# EAGLE design 3dprinter (EAGLE 8.1.1)

## Sheet 1 of 2
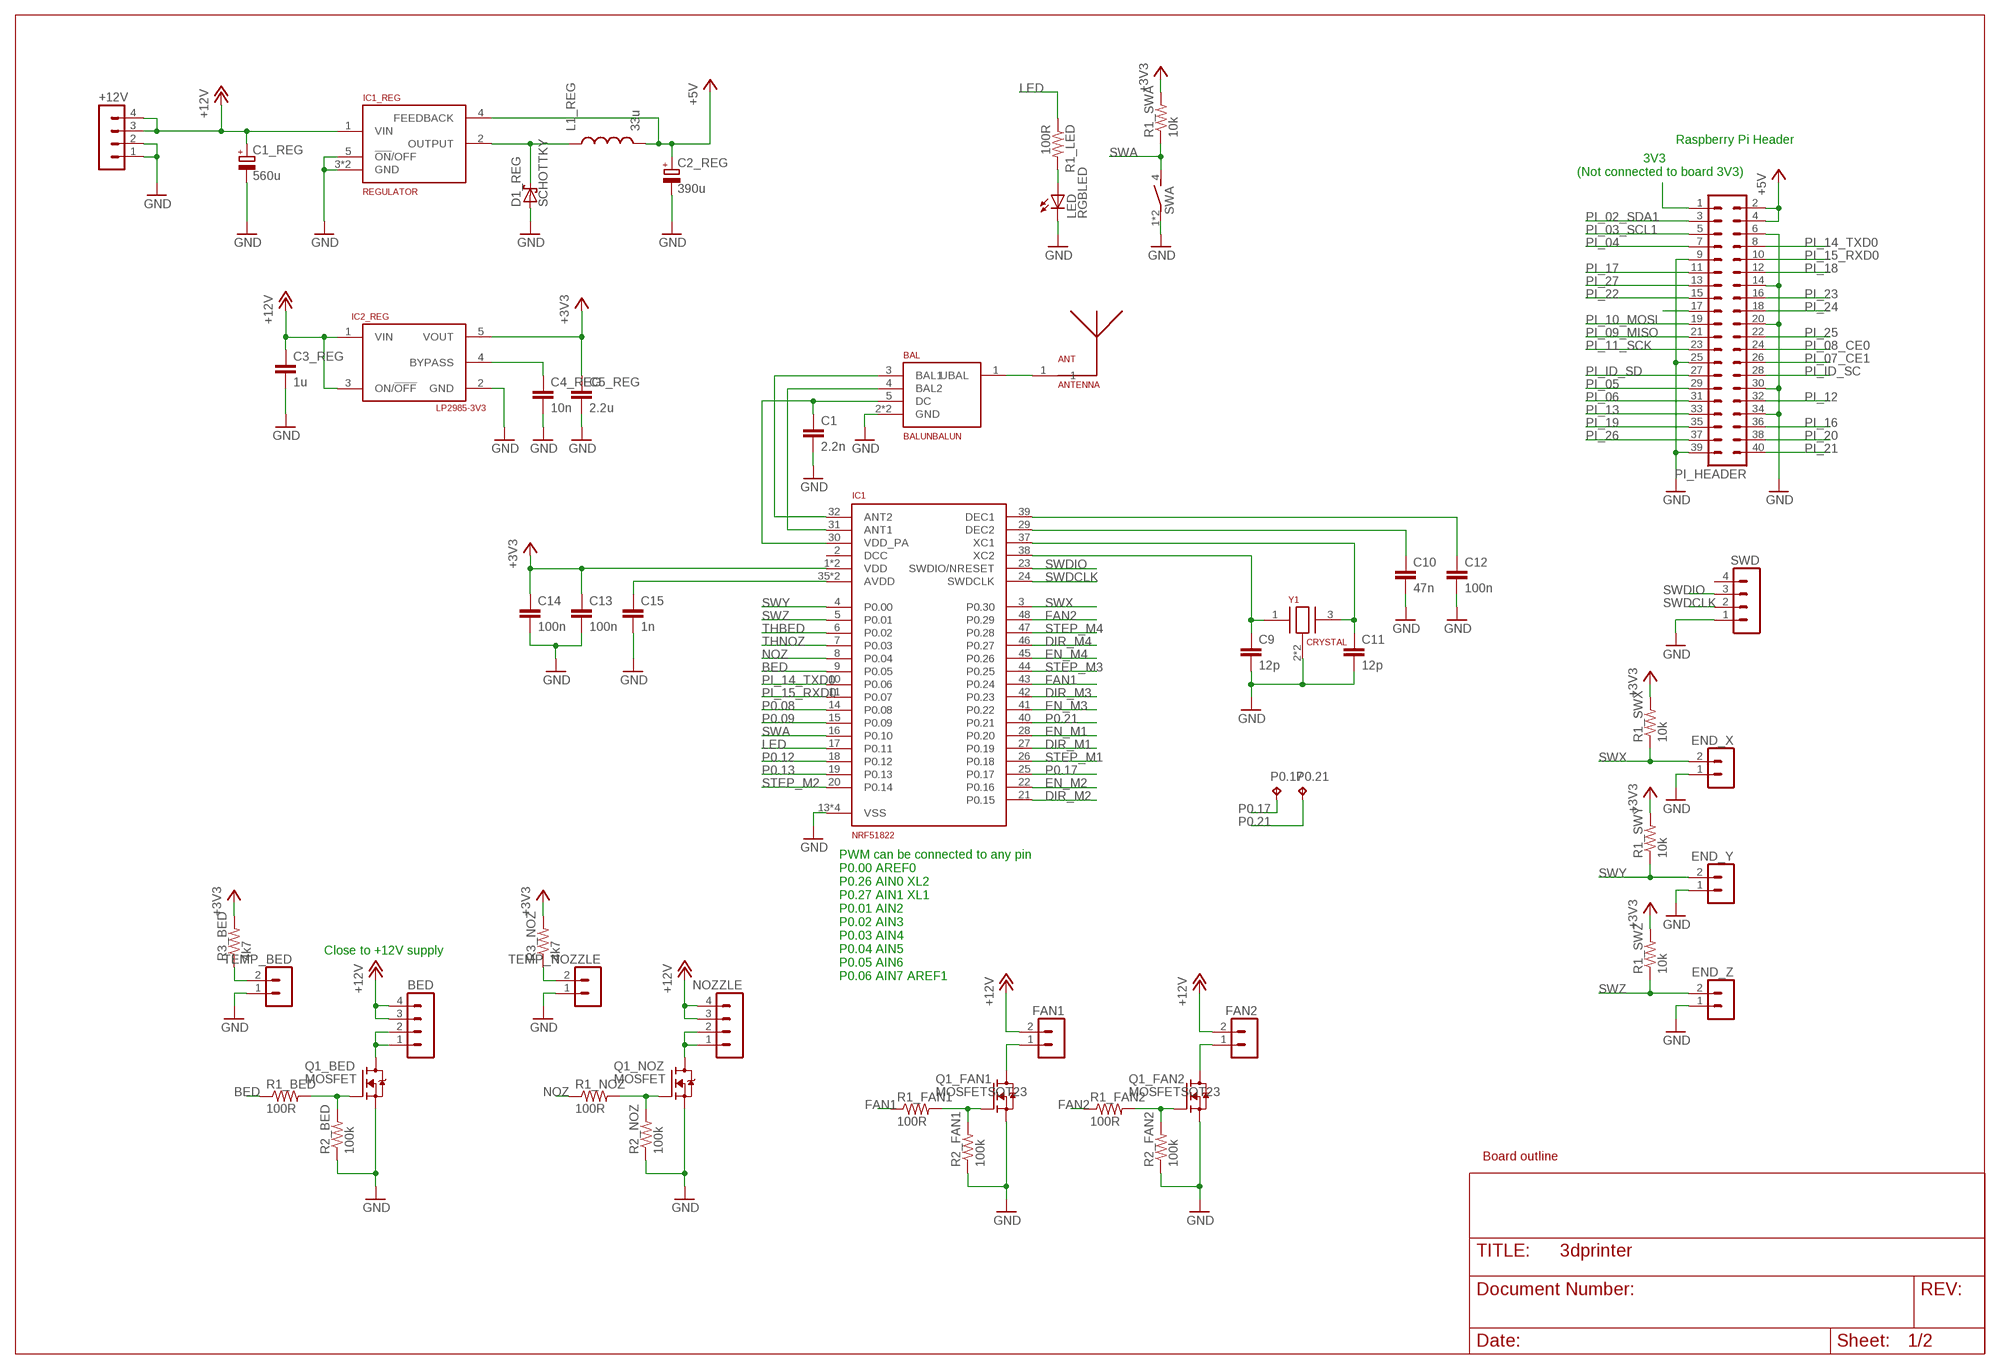
[diagram p0: schematic, sheet 1]

### Parts
+12V  MA04-15.08  [MA04-1_5MM]
ANT  ANTENNA  [ANTENNA]
BAL  BALUNBALUN  [BALUN]
BED  MA04-12.54  [MA04-1]
C1  2.2n  C-EUC0603  [C0603]
C1_REG  560u  TANTULUM  [TANTULUM]
C2_REG  390u  TANTULUM  [TANTULUM]
C3_REG  1u  C-EUC0805  [C0805]
C4_REG  10n  C-EUC0603  [C0603]
C5_REG  2.2u  C-EUC0805  [C0805]
C9  12p  C-EUC0603  [C0603]
C10  47n  C-EUC0603  [C0603]
C11  12p  C-EUC0603  [C0603]
C12  100n  C-EUC0603  [C0603]
C13  100n  C-EUC0603  [C0603]
C14  100n  C-EUC0603  [C0603]
C15  1n  C-EUC0603  [C0603]
D1_REG  SCHOTTKY  [SCHOTTKY]
END_X  MA02-12.54  [MA02-1]
END_Y  MA02-12.54  [MA02-1]
END_Z  MA02-12.54  [MA02-1]
FAN1  MA02-12.54  [MA02-1]
FAN2  MA02-12.54  [MA02-1]
IC1  NRF51822  [QFN48]
IC1_REG  REGULATOR  [REGULATOR]
IC2_REG  LP2985-3V3  [SOT23]
L1_REG  33u  INDUCTOR  [INDUCTOR]
LED  RGBLED  [RGBLED]
NOZZLE  MA04-12.54  [MA04-1]
OUTLINE  OUTLINE  [OUTLINE]
P0.17  TPB1,27  [B1,27]
P0.21  TPB1,27  [B1,27]
PI_HEADER  MA20-2  [MA20-2]
Q1_BED  MOSFET  [MOSFET]
Q1_FAN1  MOSFETSOT23  [SOT23_FAN]
Q1_FAN2  MOSFETSOT23  [SOT23_FAN]
Q1_NOZ  MOSFET  [MOSFET]
R1_BED  100R  R-US_R0603  [R0603]
R1_FAN1  100R  R-US_R0603  [R0603]
R1_FAN2  100R  R-US_R0603  [R0603]
R1_LED  100R  R-US_R0603  [R0603]
R1_NOZ  100R  R-US_R0603  [R0603]
R1_SWA  10k  R-US_R0603  [R0603]
R1_SWX  10k  R-US_R0603  [R0603]
R1_SWY  10k  R-US_R0603  [R0603]
R1_SWZ  10k  R-US_R0603  [R0603]
R2_BED  100k  R-US_R0603  [R0603]
R2_FAN1  100k  R-US_R0603  [R0603]
R2_FAN2  100k  R-US_R0603  [R0603]
R2_NOZ  100k  R-US_R0603  [R0603]
R3_BED  4k7  R-US_R0603  [R0603]
R3_NOZ  4k7  R-US_R0603  [R0603]
SWA  BUTTON  [BUTTON]
SWD  MA04-12.54  [MA04-1]
TEMP_BED  MA02-12.54  [MA02-1]
TEMP_NOZZLE  MA02-12.54  [MA02-1]
Y1  CRYSTAL  [CRYSTAL]

### Nets
+3V3: C5_REG.1 C13.1 C14.1 IC1.1(VDD) IC1.12(VDD) IC2_REG.5(VOUT) R1_SWA.2 R1_SWX.2 R1_SWY.2 R1_SWZ.2 R3_BED.2 R3_NOZ.2 ; also sheet 2
+5V: C2_REG.+ IC1_REG.4(FEEDBACK) L1_REG.2 PI_HEADER.2 PI_HEADER.4
+12V: +12V.3 +12V.4 BED.3 BED.4 C1_REG.+ C3_REG.1 FAN1.2 FAN2.2 IC1_REG.1(VIN) IC2_REG.1(VIN) IC2_REG.3(ON/!OFF) NOZZLE.3 NOZZLE.4 ; also sheet 2
ANT: ANT.1 BAL.1(UBAL)
BED: IC1.9(P0.05) R1_BED.1
BED-: BED.1 BED.2 Q1_BED.TAB(D)
BEDG: Q1_BED.4(G) R1_BED.2 R2_BED.2
DIR_M1: IC1.27(P0.19) ; also sheet 2
DIR_M2: IC1.21(P0.15) ; also sheet 2
DIR_M3: IC1.42(P0.23) ; also sheet 2
DIR_M4: IC1.46(P0.27) ; also sheet 2
EN_M1: IC1.28(P0.20) ; also sheet 2
EN_M2: IC1.22(P0.16) ; also sheet 2
EN_M3: IC1.41(P0.22) ; also sheet 2
EN_M4: IC1.45(P0.26) ; also sheet 2
FAN1: IC1.43(P0.24) R1_FAN1.1
FAN1-: FAN1.1 Q1_FAN1.3(D)
FAN1G: Q1_FAN1.1(G) R1_FAN1.2 R2_FAN1.2
FAN2: IC1.48(P0.29) R1_FAN2.1
FAN2-: FAN2.1 Q1_FAN2.3(D)
FAN2G: Q1_FAN2.1(G) R1_FAN2.2 R2_FAN2.2
GND: +12V.1 +12V.2 BAL.2(GND) BAL.6(GND) C1.2 C1_REG.- C2_REG.- C3_REG.2 C4_REG.2 C5_REG.2 C9.2 C10.2 C11.2 C12.2 C13.2 C14.2 C15.2 D1_REG.A END_X.1 END_Y.1 END_Z.1 IC1.13(VSS) IC1.33(VSS) IC1.34(VSS) IC1.PAD(VSS) IC1_REG.3(GND) IC1_REG.5(!ON!/OFF) IC1_REG.TAB(GND) IC2_REG.2(GND) LED.C PI_HEADER.6 PI_HEADER.9 PI_HEADER.14 PI_HEADER.20 PI_HEADER.25 PI_HEADER.30 PI_HEADER.34 PI_HEADER.39 Q1_BED.1(S) Q1_BED.2(S) Q1_BED.3(S) Q1_FAN1.2(S) Q1_FAN2.2(S) Q1_NOZ.1(S) Q1_NOZ.2(S) Q1_NOZ.3(S) R2_BED.1 R2_FAN1.1 R2_FAN2.1 R2_NOZ.1 SWA.1 SWA.2 SWD.1 TEMP_BED.1 TEMP_NOZZLE.1 Y1.2 Y1.4 ; also sheet 2
IC1_ANT1: BAL.3(BAL1) IC1.32(ANT2)
IC1_ANT2: BAL.4(BAL2) IC1.31(ANT1)
IC1_AVDD: C15.1 IC1.35(AVDD) IC1.36(AVDD)
IC1_DEC1: C12.1 IC1.39(DEC1)
IC1_DEC2: C10.1 IC1.29(DEC2)
IC1_REG_OUT: D1_REG.C IC1_REG.2(OUTPUT) L1_REG.1
IC1_VDD_PA: BAL.5(DC) C1.1 IC1.30(VDD_PA)
IC1_XC1: C11.1 IC1.37(XC1) Y1.3
IC1_XC2: C9.1 IC1.38(XC2) Y1.1
IC2_REG_BYPASS: C4_REG.1 IC2_REG.4(BYPASS)
LED: IC1.17(P0.11) R1_LED.1
LEDA: LED.A R1_LED.2
NOZ: IC1.8(P0.04) R1_NOZ.1
NOZ-: NOZZLE.1 NOZZLE.2 Q1_NOZ.TAB(D)
NOZG: Q1_NOZ.4(G) R1_NOZ.2 R2_NOZ.2
P0.08: IC1.14(P0.08)
P0.09: IC1.15(P0.09)
P0.12: IC1.18(P0.12)
P0.13: IC1.19(P0.13)
P0.17: IC1.25(P0.17) P0.17.TP
P0.21: IC1.40(P0.21) P0.21.TP
PI_02_SDA1: PI_HEADER.3
PI_03_SCL1: PI_HEADER.5
PI_3V3: PI_HEADER.1
PI_3V32: PI_HEADER.17
PI_04: PI_HEADER.7
PI_05: PI_HEADER.29
PI_06: PI_HEADER.31
PI_07_CE1: PI_HEADER.26
PI_08_CE0: PI_HEADER.24
PI_09_MISO: PI_HEADER.21
PI_10_MOSI: PI_HEADER.19
PI_11_SCK: PI_HEADER.23
PI_12: PI_HEADER.32
PI_13: PI_HEADER.33
PI_14_TXD0: IC1.10(P0.06) PI_HEADER.8
PI_15_RXD0: IC1.11(P0.07) PI_HEADER.10
PI_16: PI_HEADER.36
PI_17: PI_HEADER.11
PI_18: PI_HEADER.12
PI_19: PI_HEADER.35
PI_20: PI_HEADER.38
PI_21: PI_HEADER.40
PI_22: PI_HEADER.15
PI_23: PI_HEADER.16
PI_24: PI_HEADER.18
PI_25: PI_HEADER.22
PI_26: PI_HEADER.37
PI_27: PI_HEADER.13
PI_ID_SC: PI_HEADER.28
PI_ID_SD: PI_HEADER.27
STEP_M1: IC1.26(P0.18) ; also sheet 2
STEP_M2: IC1.20(P0.14) ; also sheet 2
STEP_M3: IC1.44(P0.25) ; also sheet 2
STEP_M4: IC1.47(P0.28) ; also sheet 2
SWA: IC1.16(P0.10) R1_SWA.1 SWA.4
SWDCLK: IC1.24(SWDCLK) SWD.2
SWDIO: IC1.23(SWDIO/NRESET) SWD.3
SWX: END_X.2 IC1.3(P0.30) R1_SWX.1
SWY: END_Y.2 IC1.4(P0.00) R1_SWY.1
SWZ: END_Z.2 IC1.5(P0.01) R1_SWZ.1
THBED: IC1.6(P0.02) R3_BED.1 TEMP_BED.2
THNOZ: IC1.7(P0.03) R3_NOZ.1 TEMP_NOZZLE.2
Unconnected: IC1.2(DCC) SWD.4

### Notes on the sheet
- Raspberry Pi Header
- 3V3
  (Not connected to board 3V3)
- Close to +12V supply
- PWM can be connected to any pin
  P0.00 AREF0
  P0.26 AIN0 XL2
  P0.27 AIN1 XL1
  P0.01 AIN2
  P0.02 AIN3
  P0.03 AIN4
  P0.04 AIN5
  P0.05 AIN6
  P0.06 AIN7 AREF1

## Sheet 2 of 2
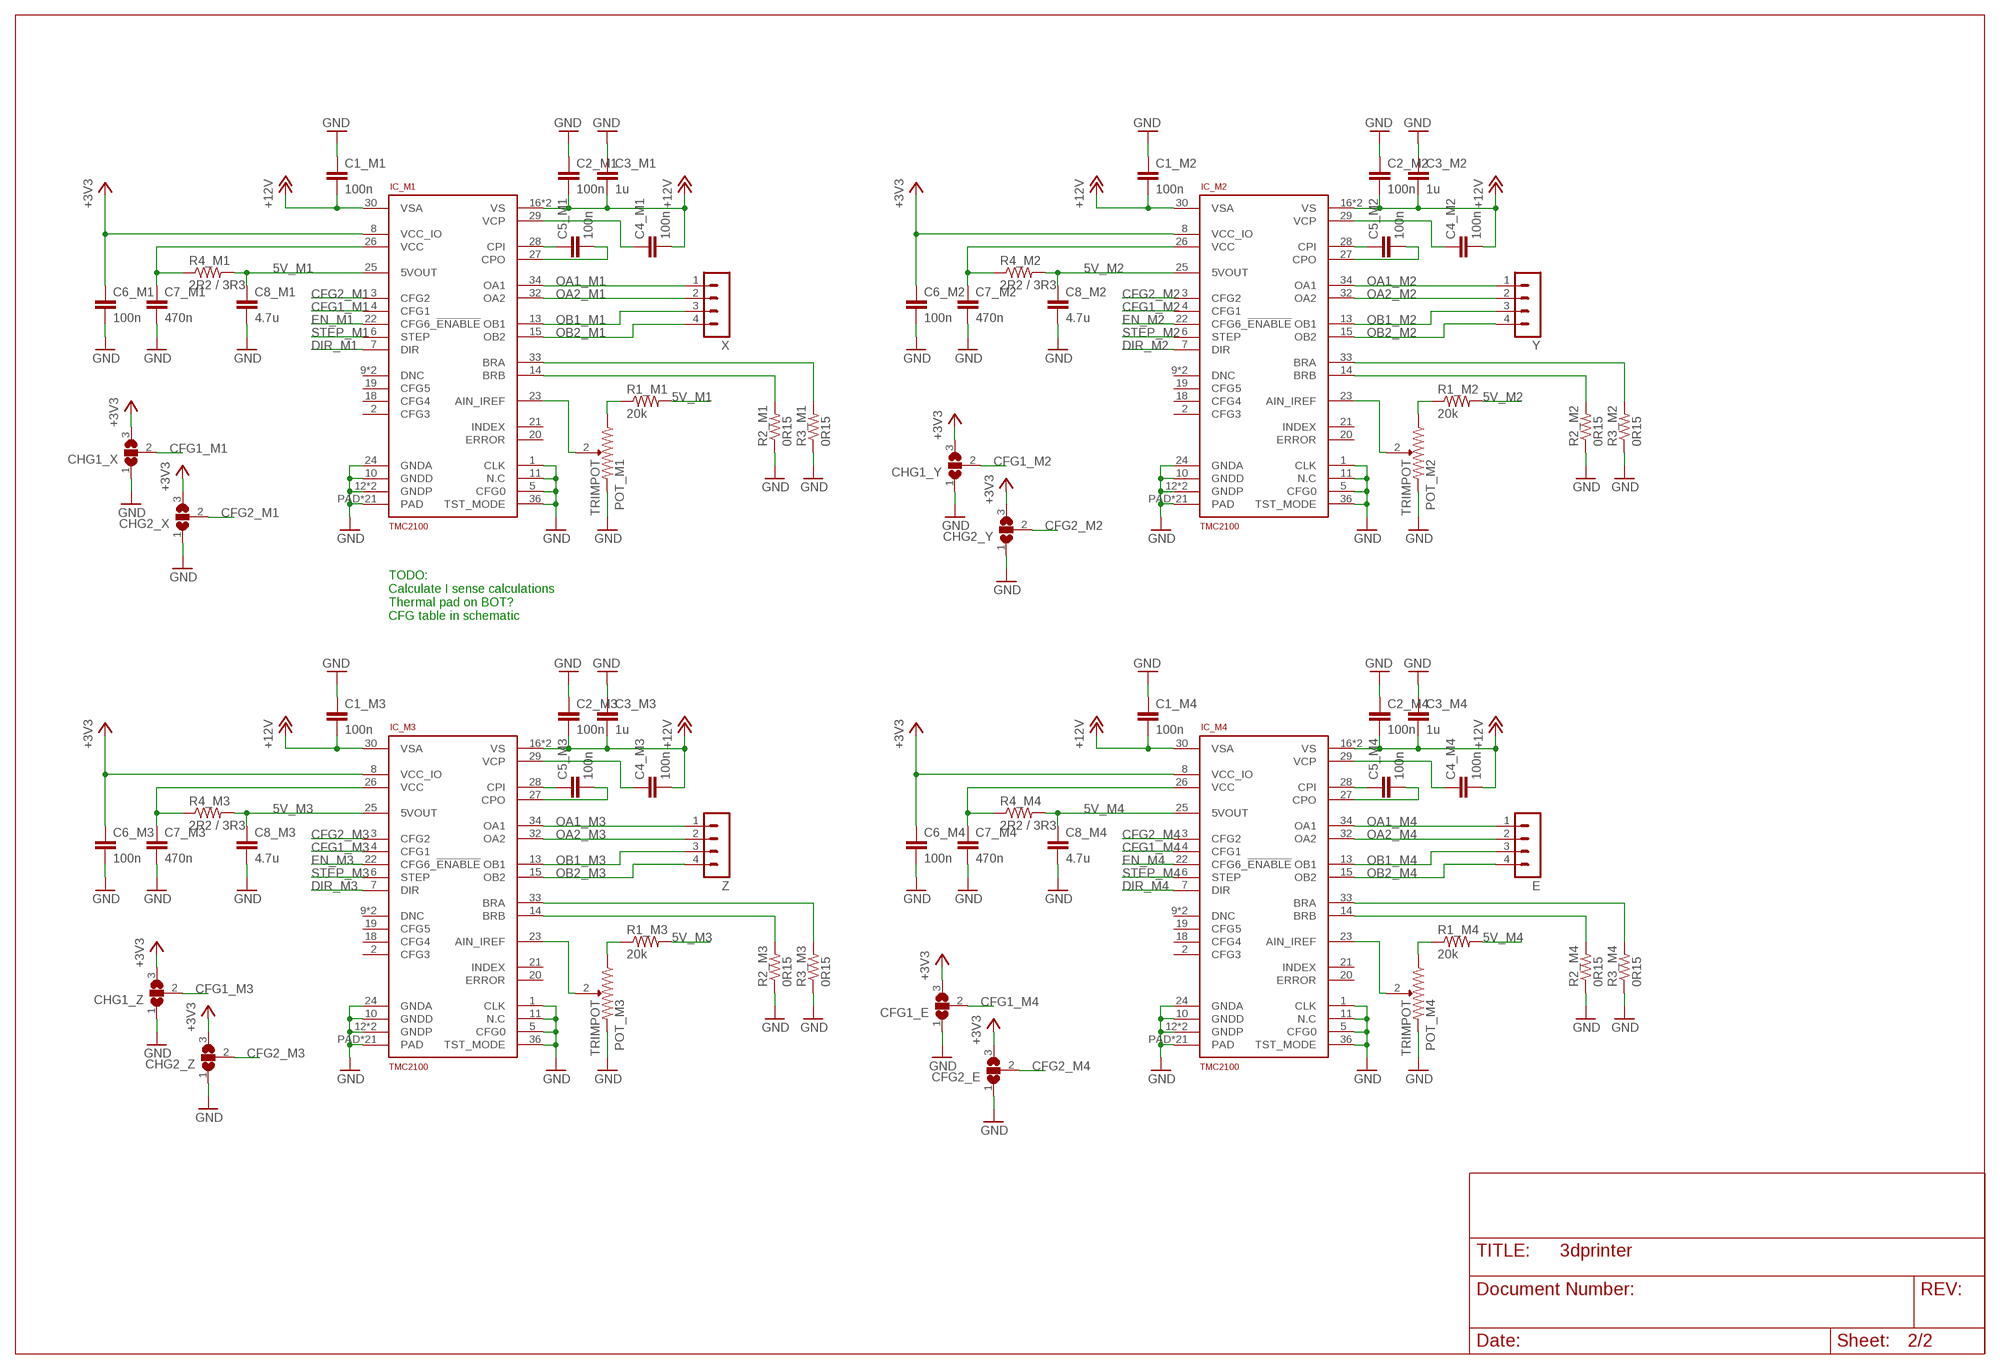
[diagram p1: schematic, sheet 2]

### Parts
C1_M1  100n  C-EUC0603  [C0603]
C1_M2  100n  C-EUC0603  [C0603]
C1_M3  100n  C-EUC0603  [C0603]
C1_M4  100n  C-EUC0603  [C0603]
C2_M1  100n  C-EUC0603  [C0603]
C2_M2  100n  C-EUC0603  [C0603]
C2_M3  100n  C-EUC0603  [C0603]
C2_M4  100n  C-EUC0603  [C0603]
C3_M1  1u  C-EUC0603  [C0603]
C3_M2  1u  C-EUC0603  [C0603]
C3_M3  1u  C-EUC0603  [C0603]
C3_M4  1u  C-EUC0603  [C0603]
C4_M1  100n  C-EUC0603  [C0603]
C4_M2  100n  C-EUC0603  [C0603]
C4_M3  100n  C-EUC0603  [C0603]
C4_M4  100n  C-EUC0603  [C0603]
C5_M1  100n  C-EUC0603  [C0603]
C5_M2  100n  C-EUC0603  [C0603]
C5_M3  100n  C-EUC0603  [C0603]
C5_M4  100n  C-EUC0603  [C0603]
C6_M1  100n  C-EUC0603  [C0603]
C6_M2  100n  C-EUC0603  [C0603]
C6_M3  100n  C-EUC0603  [C0603]
C6_M4  100n  C-EUC0603  [C0603]
C7_M1  470n  C-EUC0603  [C0603]
C7_M2  470n  C-EUC0603  [C0603]
C7_M3  470n  C-EUC0603  [C0603]
C7_M4  470n  C-EUC0603  [C0603]
C8_M1  4.7u  C-EUC0603  [C0603]
C8_M2  4.7u  C-EUC0603  [C0603]
C8_M3  4.7u  C-EUC0603  [C0603]
C8_M4  4.7u  C-EUC0603  [C0603]
CFG1_E  SJ2W  [SJ_2]
CFG2_E  SJ2W  [SJ_2]
CHG1_X  SJ2W  [SJ_2]
CHG1_Y  SJ2W  [SJ_2]
CHG1_Z  SJ2W  [SJ_2]
CHG2_X  SJ2W  [SJ_2]
CHG2_Y  SJ2W  [SJ_2]
CHG2_Z  SJ2W  [SJ_2]
E  MA04-12.54  [MA04-1]
IC_M1  TMC2100  [QFN36]
IC_M2  TMC2100  [QFN36]
IC_M3  TMC2100  [QFN36]
IC_M4  TMC2100  [QFN36]
POT_M1  TRIMPOT  [TRIMPOT]
POT_M2  TRIMPOT  [TRIMPOT]
POT_M3  TRIMPOT  [TRIMPOT]
POT_M4  TRIMPOT  [TRIMPOT]
R1_M1  20k  R-US_R0603  [R0603]
R1_M2  20k  R-US_R0603  [R0603]
R1_M3  20k  R-US_R0603  [R0603]
R1_M4  20k  R-US_R0603  [R0603]
R2_M1  0R15  R-US_R0805  [R0805]
R2_M2  0R15  R-US_R0805  [R0805]
R2_M3  0R15  R-US_R0805  [R0805]
R2_M4  0R15  R-US_R0805  [R0805]
R3_M1  0R15  R-US_R0805  [R0805]
R3_M2  0R15  R-US_R0805  [R0805]
R3_M3  0R15  R-US_R0805  [R0805]
R3_M4  0R15  R-US_R0805  [R0805]
R4_M1  2R2 / 3R3  R-US_R0603  [R0603]
R4_M2  2R2 / 3R3  R-US_R0603  [R0603]
R4_M3  2R2 / 3R3  R-US_R0603  [R0603]
R4_M4  2R2 / 3R3  R-US_R0603  [R0603]
X  MA04-12.54  [MA04-1]
Y  MA04-12.54  [MA04-1]
Z  MA04-12.54  [MA04-1]

### Nets
5V_M1: C8_M1.1 IC_M1.25(5VOUT) R1_M1.2 R4_M1.2
5V_M2: C8_M2.1 IC_M2.25(5VOUT) R1_M2.2 R4_M2.2
5V_M3: C8_M3.1 IC_M3.25(5VOUT) R1_M3.2 R4_M3.2
5V_M4: C8_M4.1 IC_M4.25(5VOUT) R1_M4.2 R4_M4.2
+3V3: C6_M1.1 C6_M2.1 C6_M3.1 C6_M4.1 CFG1_E.3 CFG2_E.3 CHG1_X.3 CHG1_Y.3 CHG1_Z.3 CHG2_X.3 CHG2_Y.3 CHG2_Z.3 IC_M1.8(VCC_IO) IC_M2.8(VCC_IO) IC_M3.8(VCC_IO) IC_M4.8(VCC_IO) ; also sheet 1
+12V: C1_M1.2 C1_M2.2 C1_M3.2 C1_M4.2 C2_M1.2 C2_M2.2 C2_M3.2 C2_M4.2 C3_M1.2 C3_M2.2 C3_M3.2 C3_M4.2 C4_M1.2 C4_M2.2 C4_M3.2 C4_M4.2 IC_M1.16(VS) IC_M1.30(VSA) IC_M1.31(VS) IC_M2.16(VS) IC_M2.30(VSA) IC_M2.31(VS) IC_M3.16(VS) IC_M3.30(VSA) IC_M3.31(VS) IC_M4.16(VS) IC_M4.30(VSA) IC_M4.31(VS) ; also sheet 1
AIN_M1: IC_M1.23(AIN_IREF) POT_M1.2
AIN_M2: IC_M2.23(AIN_IREF) POT_M2.2
AIN_M3: IC_M3.23(AIN_IREF) POT_M3.2
AIN_M4: IC_M4.23(AIN_IREF) POT_M4.2
BRA_M1: IC_M1.33(BRA) R3_M1.2
BRA_M2: IC_M2.33(BRA) R3_M2.2
BRA_M3: IC_M3.33(BRA) R3_M3.2
BRA_M4: IC_M4.33(BRA) R3_M4.2
BRB_M1: IC_M1.14(BRB) R2_M1.2
BRB_M2: IC_M2.14(BRB) R2_M2.2
BRB_M3: IC_M3.14(BRB) R2_M3.2
BRB_M4: IC_M4.14(BRB) R2_M4.2
CFG1_M1: CHG1_X.2 IC_M1.4(CFG1)
CFG1_M2: CHG1_Y.2 IC_M2.4(CFG1)
CFG1_M3: CHG1_Z.2 IC_M3.4(CFG1)
CFG1_M4: CFG1_E.2 IC_M4.4(CFG1)
CFG2_M1: CHG2_X.2 IC_M1.3(CFG2)
CFG2_M2: CHG2_Y.2 IC_M2.3(CFG2)
CFG2_M3: CHG2_Z.2 IC_M3.3(CFG2)
CFG2_M4: CFG2_E.2 IC_M4.3(CFG2)
CPI_M1: C5_M1.1 IC_M1.28(CPI)
CPI_M2: C5_M2.1 IC_M2.28(CPI)
CPI_M3: C5_M3.1 IC_M3.28(CPI)
CPI_M4: C5_M4.1 IC_M4.28(CPI)
CPO_M1: C5_M1.2 IC_M1.27(CPO)
CPO_M2: C5_M2.2 IC_M2.27(CPO)
CPO_M3: C5_M3.2 IC_M3.27(CPO)
CPO_M4: C5_M4.2 IC_M4.27(CPO)
DIR_M1: IC_M1.7(DIR) ; also sheet 1
DIR_M2: IC_M2.7(DIR) ; also sheet 1
DIR_M3: IC_M3.7(DIR) ; also sheet 1
DIR_M4: IC_M4.7(DIR) ; also sheet 1
EN_M1: IC_M1.22(CFG6_!ENABLE) ; also sheet 1
EN_M2: IC_M2.22(CFG6_!ENABLE) ; also sheet 1
EN_M3: IC_M3.22(CFG6_!ENABLE) ; also sheet 1
EN_M4: IC_M4.22(CFG6_!ENABLE) ; also sheet 1
GND: C1_M1.1 C1_M2.1 C1_M3.1 C1_M4.1 C2_M1.1 C2_M2.1 C2_M3.1 C2_M4.1 C3_M1.1 C3_M2.1 C3_M3.1 C3_M4.1 C6_M1.2 C6_M2.2 C6_M3.2 C6_M4.2 C7_M1.2 C7_M2.2 C7_M3.2 C7_M4.2 C8_M1.2 C8_M2.2 C8_M3.2 C8_M4.2 CFG1_E.1 CFG2_E.1 CHG1_X.1 CHG1_Y.1 CHG1_Z.1 CHG2_X.1 CHG2_Y.1 CHG2_Z.1 IC_M1.1(CLK) IC_M1.5(CFG0) IC_M1.10(GNDD) IC_M1.11(N.C) IC_M1.12(GNDP) IC_M1.24(GNDA) IC_M1.35(GNDP) IC_M1.36(TST_MODE) IC_M1.PAD IC_M1.TVIA1(PAD) IC_M1.TVIA2(PAD) IC_M1.TVIA3(PAD) IC_M1.TVIA4(PAD) IC_M1.TVIA5(PAD) IC_M1.TVIA6(PAD) IC_M1.TVIA7(PAD) IC_M1.TVIA8(PAD) IC_M1.TVIA9(PAD) IC_M1.TVIA10(PAD) IC_M1.TVIA11(PAD) IC_M1.TVIA12(PAD) IC_M1.TVIA13(PAD) IC_M1.TVIA14(PAD) IC_M1.TVIA15(PAD) IC_M1.TVIA16(PAD) IC_M1.TVIA17(PAD) IC_M1.TVIA18(PAD) IC_M1.TVIA19(PAD) IC_M1.TVIA20(PAD) IC_M2.1(CLK) IC_M2.5(CFG0) IC_M2.10(GNDD) IC_M2.11(N.C) IC_M2.12(GNDP) IC_M2.24(GNDA) IC_M2.35(GNDP) IC_M2.36(TST_MODE) IC_M2.PAD IC_M2.TVIA1(PAD) IC_M2.TVIA2(PAD) IC_M2.TVIA3(PAD) IC_M2.TVIA4(PAD) IC_M2.TVIA5(PAD) IC_M2.TVIA6(PAD) IC_M2.TVIA7(PAD) IC_M2.TVIA8(PAD) IC_M2.TVIA9(PAD) IC_M2.TVIA10(PAD) IC_M2.TVIA11(PAD) IC_M2.TVIA12(PAD) IC_M2.TVIA13(PAD) IC_M2.TVIA14(PAD) IC_M2.TVIA15(PAD) IC_M2.TVIA16(PAD) IC_M2.TVIA17(PAD) IC_M2.TVIA18(PAD) IC_M2.TVIA19(PAD) IC_M2.TVIA20(PAD) IC_M3.1(CLK) IC_M3.5(CFG0) IC_M3.10(GNDD) IC_M3.11(N.C) IC_M3.12(GNDP) IC_M3.24(GNDA) IC_M3.35(GNDP) IC_M3.36(TST_MODE) IC_M3.PAD IC_M3.TVIA1(PAD) IC_M3.TVIA2(PAD) IC_M3.TVIA3(PAD) IC_M3.TVIA4(PAD) IC_M3.TVIA5(PAD) IC_M3.TVIA6(PAD) IC_M3.TVIA7(PAD) IC_M3.TVIA8(PAD) IC_M3.TVIA9(PAD) IC_M3.TVIA10(PAD) IC_M3.TVIA11(PAD) IC_M3.TVIA12(PAD) IC_M3.TVIA13(PAD) IC_M3.TVIA14(PAD) IC_M3.TVIA15(PAD) IC_M3.TVIA16(PAD) IC_M3.TVIA17(PAD) IC_M3.TVIA18(PAD) IC_M3.TVIA19(PAD) IC_M3.TVIA20(PAD) IC_M4.1(CLK) IC_M4.5(CFG0) IC_M4.10(GNDD) IC_M4.11(N.C) IC_M4.12(GNDP) IC_M4.24(GNDA) IC_M4.35(GNDP) IC_M4.36(TST_MODE) IC_M4.PAD IC_M4.TVIA1(PAD) IC_M4.TVIA2(PAD) IC_M4.TVIA3(PAD) IC_M4.TVIA4(PAD) IC_M4.TVIA5(PAD) IC_M4.TVIA6(PAD) IC_M4.TVIA7(PAD) IC_M4.TVIA8(PAD) IC_M4.TVIA9(PAD) IC_M4.TVIA10(PAD) IC_M4.TVIA11(PAD) IC_M4.TVIA12(PAD) IC_M4.TVIA13(PAD) IC_M4.TVIA14(PAD) IC_M4.TVIA15(PAD) IC_M4.TVIA16(PAD) IC_M4.TVIA17(PAD) IC_M4.TVIA18(PAD) IC_M4.TVIA19(PAD) IC_M4.TVIA20(PAD) POT_M1.3 POT_M2.3 POT_M3.3 POT_M4.3 R2_M1.1 R2_M2.1 R2_M3.1 R2_M4.1 R3_M1.1 R3_M2.1 R3_M3.1 R3_M4.1 ; also sheet 1
OA1_M1: IC_M1.34(OA1) X.1
OA1_M2: IC_M2.34(OA1) Y.1
OA1_M3: IC_M3.34(OA1) Z.1
OA1_M4: E.1 IC_M4.34(OA1)
OA2_M1: IC_M1.32(OA2) X.2
OA2_M2: IC_M2.32(OA2) Y.2
OA2_M3: IC_M3.32(OA2) Z.2
OA2_M4: E.2 IC_M4.32(OA2)
OB1_M1: IC_M1.13(OB1) X.3
OB1_M2: IC_M2.13(OB1) Y.3
OB1_M3: IC_M3.13(OB1) Z.3
OB1_M4: E.3 IC_M4.13(OB1)
OB2_M1: IC_M1.15(OB2) X.4
OB2_M2: IC_M2.15(OB2) Y.4
OB2_M3: IC_M3.15(OB2) Z.4
OB2_M4: E.4 IC_M4.15(OB2)
POT_M1: POT_M1.1 R1_M1.1
POT_M2: POT_M2.1 R1_M2.1
POT_M3: POT_M3.1 R1_M3.1
POT_M4: POT_M4.1 R1_M4.1
STEP_M1: IC_M1.6(STEP) ; also sheet 1
STEP_M2: IC_M2.6(STEP) ; also sheet 1
STEP_M3: IC_M3.6(STEP) ; also sheet 1
STEP_M4: IC_M4.6(STEP) ; also sheet 1
VCC_M1: C7_M1.1 IC_M1.26(VCC) R4_M1.1
VCC_M2: C7_M2.1 IC_M2.26(VCC) R4_M2.1
VCC_M3: C7_M3.1 IC_M3.26(VCC) R4_M3.1
VCC_M4: C7_M4.1 IC_M4.26(VCC) R4_M4.1
VCP_M1: C4_M1.1 IC_M1.29(VCP)
VCP_M2: C4_M2.1 IC_M2.29(VCP)
VCP_M3: C4_M3.1 IC_M3.29(VCP)
VCP_M4: C4_M4.1 IC_M4.29(VCP)
Unconnected: IC_M1.2(CFG3) IC_M1.9(DNC) IC_M1.17(DNC) IC_M1.18(CFG4) IC_M1.19(CFG5) IC_M1.20(ERROR) IC_M1.21(INDEX) IC_M2.2(CFG3) IC_M2.9(DNC) IC_M2.17(DNC) IC_M2.18(CFG4) IC_M2.19(CFG5) IC_M2.20(ERROR) IC_M2.21(INDEX) IC_M3.2(CFG3) IC_M3.9(DNC) IC_M3.17(DNC) IC_M3.18(CFG4) IC_M3.19(CFG5) IC_M3.20(ERROR) IC_M3.21(INDEX) IC_M4.2(CFG3) IC_M4.9(DNC) IC_M4.17(DNC) IC_M4.18(CFG4) IC_M4.19(CFG5) IC_M4.20(ERROR) IC_M4.21(INDEX)

### Notes on the sheet
- TODO:
  Calculate I sense calculations
  Thermal pad on BOT?
  CFG table in schematic

## Library data of the parts
+12V = 3dprinter:MA04-1: PIN HEADER; DIGIKEY: ED2699-ND / ED2910-ND
ANT = 3dprinter:ANTENNA: Antenna Datasheet <https://www.johansontechnology.com/datasheets/antennas/2450AT43B100.pdf>; DIGIKEY: 712-1010-1-ND
BAL = 3dprinter:BALUN: Balun Datasheet <https://www.johansontechnology.com/datasheets/baluns/2450BM14E0003.pdf>; DIGIKEY: 712-1581-1-ND
BED E NOZZLE SWD X Y Z = 3dprinter:MA04-1: PIN HEADER; OC_FARNELL: unknown; OC_NEWARK: unknown
C1 C1_M1-C1_M4 C2_M1-C2_M4 C3_M1-C3_M4 C3_REG C4_M1-C4_M4 C4_REG C5_M1-C5_M4 C5_REG C6_M1-C6_M4 C7_M1-C7_M4 C8_M1-C8_M4 C9-C15 = 3dprinter:C-EU: CAPACITOR, European symbol
C1_REG C2_REG = 3dprinter:TANTULUM: Tantulum Capacitor Datasheet <http://www.chemi-con.co.jp/cgi-bin/CAT_DB/SEARCH/cat_db_al.cgi?e=e&j=p&pdfname=pxg>; DIGIKEY: 565-4300-1-ND / 565-4301-1-ND
CFG1_E CFG2_E CHG1_X CHG1_Y CHG1_Z CHG2_X CHG2_Y CHG2_Z = 3dprinter:SJ2W: SMD solder JUMPER
D1_REG = 3dprinter:SCHOTTKY: Schottky Diode Datasheet <http://rohmfs.rohm.com/en/products/databook/datasheet/discrete/diode/schottky_barrier/rsx501l-20.pdf>; DIGIKEY: RSX501L-20TE25CT-ND
END_X END_Y END_Z FAN1 FAN2 TEMP_BED TEMP_NOZZLE = 3dprinter:MA02-1: PIN HEADER; OC_FARNELL: unknown; OC_NEWARK: unknown
IC1 = 3dprinter:NRF51822: NRF51822 Nordic NRF51822 Datasheet <http://infocenter.nordicsemi.com/pdf/nRF51822_PS_v3.1.pdf>; DIGIKEY: 1490-1025-ND
IC1_REG = 3dprinter:REGULATOR: 5V Regulator Datasheet <http://www.ti.com/lit/ds/symlink/lm2596.pdf>; DIGIKEY: LM2596SX-5.0/NOPBCT-ND
IC2_REG = 3dprinter:LP2985-3V3: LP2985 3.3V regulator Datasheet <http://www.electrokit.com/productFile/download/940>; DIGIKEY: 296-18476-1-ND
IC_M1-IC_M4 = 3dprinter:TMC2100: TMC2100 Stepper motor driver Datasheet <https://www.trinamic.com/fileadmin/assets/Products/ICs_Documents/TMC2100_datasheet.pdf>; DIGIKEY: 1460-1128-1-ND
L1_REG = 3dprinter:INDUCTOR: Inductor Datasheet <http://www.bourns.com/docs/Product-Datasheets/PM124SH_SERIES.pdf>; DIGIKEY: PM124SH-330M-RCCT-ND
LED = 3dprinter:RGBLED: RGB LED Datasheet <http://optoelectronics.liteon.com/upload/download/DS22-2000-228/S_110_LTST-C191KGKT.pdf>; DIGIKEY: 160-1446-1-ND
OUTLINE = 3dprinter:OUTLINE: Board outline The pcb fit a Raspberry Pi model B
P0.17 P0.21 = 3dprinter:TP: Test pad
PI_HEADER = 3dprinter:MA20-2: PIN HEADER; OC_FARNELL: unknown; OC_NEWARK: unknown
POT_M1-POT_M4 = 3dprinter:TRIMPOT: Trimpot Bourns Inc. 3314R-1-103E Datasheet <http://www.bourns.com/docs/Product-Datasheets/3314.pdf>; DIGIKEY: 3314R-1-103ECT-ND
Q1_BED Q1_NOZ = 3dprinter:MOSFET: MOSFET Datasheet POWER <http://www.onsemi.com/pub/Collateral/NTMFS5C604NL-D.PDF> Datasheet SOT23 <http://www.infineon.com/dgdl/BSS316N_Rev2.3.pdf?folderId=db3a3043156fd573011622e10b5c1f67&fileId=db3a304330f686060130ff7ee4b07f16>; DIGIKEY: NTMFS5C604NLT1GOSCT-ND
Q1_FAN1 Q1_FAN2 = 3dprinter:MOSFET: MOSFET Datasheet POWER <http://www.onsemi.com/pub/Collateral/NTMFS5C604NL-D.PDF> Datasheet SOT23 <http://www.infineon.com/dgdl/BSS316N_Rev2.3.pdf?folderId=db3a3043156fd573011622e10b5c1f67&fileId=db3a304330f686060130ff7ee4b07f16>; DIGIKEY: BSS316N H6327CT-ND
R1_BED R1_FAN1 R1_FAN2 R1_LED R1_M1-R1_M4 R1_NOZ R1_SWA R1_SWX R1_SWY R1_SWZ R2_BED R2_FAN1 R2_FAN2 R2_M1-R2_M4 R2_NOZ R3_BED R3_M1-R3_M4 R3_NOZ R4_M1-R4_M4 = 3dprinter:R-US_: RESISTOR, American symbol
SWA = 3dprinter:BUTTON: Tactile button Datasheet <http://www.ckswitches.com/media/1471/pts645.pdf>; DIGIKEY: CKN9085CT-ND
Y1 = 3dprinter:CRYSTAL: AVX Corp/Kyocera Corp CX2520DB16000D0GPSC1 16MHz Datasheet <https://media.digikey.com/pdf/Data%20Sheets/AVX%20PDFs/CX2520DB_USY1M-H1-16428-00_Spec.pdf>; DIGIKEY: 1253-1718-1-ND

## Board
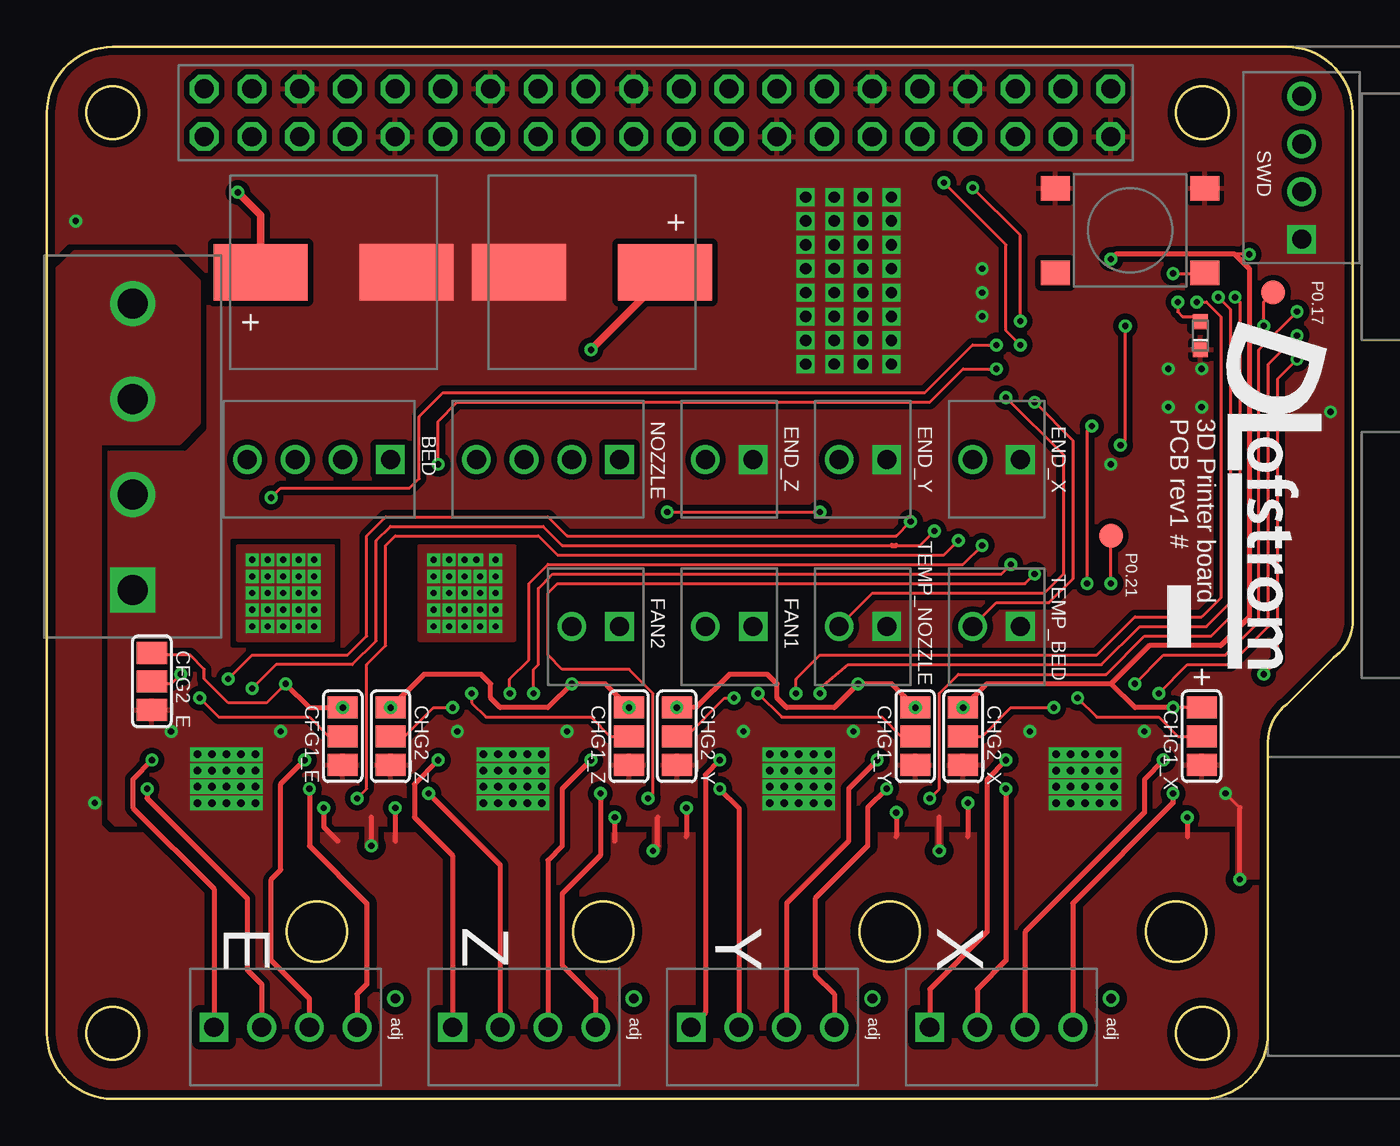
[diagram p2: board, top side]
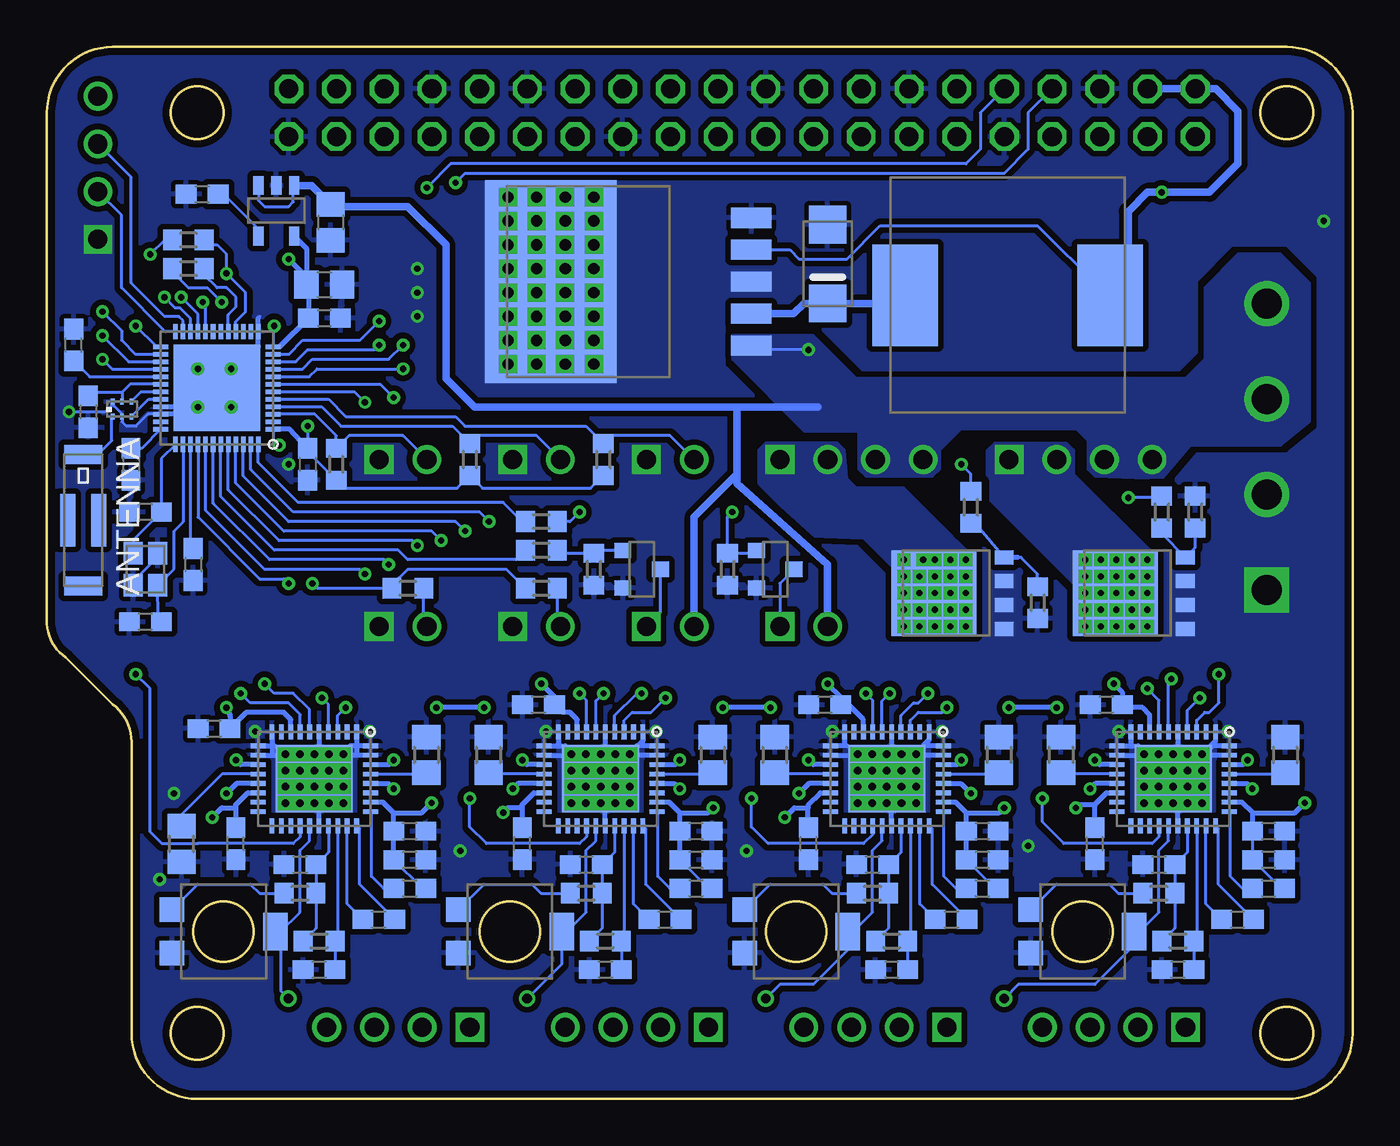
[diagram p3: board, bottom side, seen from below]

Size 69.5 x 56 mm. Coordinates in mm from the lower left corner, seen from the top.
Copper layers (1*16): Top 0.0356mm / dielectric 1.5011mm / Bottom 0.0356mm
Design rules "oshpark-2layer *": minimum track width 6mil, minimum drill 13mil, track to track 6mil, track to pad 6mil, pad to pad 6mil, via to via 6mil, smd to smd 6mil, copper to edge 15mil, drill to drill 6mil, minimum pad ring 7mil, minimum via ring 7mil, stop-mask expansion 2.5mil, vias tented up to drill 13mil, thermal gap 10mil

### Footprints (pad centres in the part's own frame; a part is rotated, then mirrored left to right if it is on the bottom)
MA04-1_5MM = drill 1.6 square: 1 -7.62,0 | drill 1.6: 2 -2.54,0; 3 2.54,0; 4 7.62,0
ANTENNA = smd 1 x 2: 1 3.5,0; 2 -3.5,0 | smd 2.8 x 0.8: 3 0,0.815; 4 0,-0.815
BALUN = smd 0.2 x 0.3: 1 0.5,0.4; 2 0,0.4; 3 -0.5,0.4; 4 -0.5,-0.4; 5 0,-0.4; 6 0.5,-0.4
MA04-1 = drill 1.016 square: 1 -3.81,0 | drill 1.016: 2 -1.27,0; 3 1.27,0; 4 3.81,0
C0603 = smd 1.1 x 1: 1 -0.85,0; 2 0.85,0
TANTULUM = smd 3 x 5: + 0,3.875; - 0,-3.875
C0805 = smd 1.3 x 1.5: 1 -0.95,0; 2 0.95,0
SJ_2 = smd 1.168 x 1.6: 1 -1.524,0; 2 0,0; 3 1.524,0
SCHOTTKY = smd 2 x 2: A -2.1,0; C 2.1,0
MA02-1 = drill 1.016 square: 1 -2.54,0 | drill 1.016: 2 0,0
QFN48 = smd 0.8 x 0.24: 1 -3,2.2; 2 -3,1.8; 3 -3,1.4; 4 -3,1; 5 -3,0.6; 6 -3,0.2; 7 -3,-0.2; 8 -3,-0.6; 9 -3,-1; 10 -3,-1.4; 11 -3,-1.8; 12 -3,-2.2; 25 3,-2.2; 26 3,-1.8; 27 3,-1.4; 28 3,-1; 29 3,-0.6; 30 3,-0.2; 31 3,0.2; 32 3,0.6; 33 3,1; 34 3,1.4; 35 3,1.8; 36 3,2.2 | smd 0.24 x 0.8: 13 -2.2,-3; 14 -1.8,-3; 15 -1.4,-3; 16 -1,-3; 17 -0.6,-3; 18 -0.2,-3; 19 0.2,-3; 20 0.6,-3; 21 1,-3; 22 1.4,-3; 23 1.8,-3; 24 2.2,-3; 37 2.2,3; 38 1.8,3; 39 1.4,3; 40 1,3; 41 0.6,3; 42 0.2,3; 43 -0.2,3; 44 -0.6,3; 45 -1,3; 46 -1.4,3; 47 -1.8,3; 48 -2.2,3 | smd 4.6 x 4.6: PAD 0,0
REGULATOR = smd 2.16 x 1.07: 1 0,-3.4; 2 0,-1.7; 3 0,0; 4 0,1.7; 5 0,3.4 | smd 6.99 x 10.8: TAB -10.675,0
SOT23 = smd 0.55 x 1: 1 -0.95,-1.35; 2 0,-1.35; 3 0.95,-1.35; 4 0.95,1.35; 5 -0.95,1.35
QFN36 = smd 0.8 x 0.25: 1 -2.5,2.25; 2 -2.5,1.75; 3 -2.5,1.25; 4 -2.5,0.75; 5 -2.5,0.25; 6 -2.5,-0.25; 7 -2.5,-0.75; 8 -2.5,-1.25; 9 -2.5,-1.75; 10 -2.5,-2.25; 19 2.5,-2.25; 20 2.5,-1.75; 21 2.5,-1.25; 22 2.5,-0.75; 23 2.5,-0.25; 24 2.5,0.25; 25 2.5,0.75; 26 2.5,1.25; 27 2.5,1.75; 28 2.5,2.25 | smd 0.25 x 0.8: 11 -1.75,-3; 12 -1.25,-3; 13 -0.75,-3; 14 -0.25,-3; 15 0.25,-3; 16 0.75,-3; 17 1.25,-3; 18 1.75,-3; 29 1.75,3; 30 1.25,3; 31 0.75,3; 32 0.25,3; 33 -0.25,3; 34 -0.75,3; 35 -1.25,3; 36 -1.75,3 | smd 3.6 x 4.1: PAD 0,0 | drill 0.4 square: TVIA1 -1.3,1.55; TVIA2 -0.425,1.55; TVIA3 0.425,1.55; TVIA4 1.3,1.55; TVIA5 -1.3,0.775; TVIA6 -0.425,0.775; TVIA7 0.425,0.775; TVIA8 1.3,0.775; TVIA9 -1.3,0; TVIA10 -0.425,0; TVIA11 0.425,0; TVIA12 1.3,0; TVIA13 -1.3,-0.775; TVIA14 -0.425,-0.775; TVIA15 0.425,-0.775; TVIA16 1.3,-0.775; TVIA17 -1.3,-1.55; TVIA18 -0.425,-1.55; TVIA19 0.425,-1.55; TVIA20 1.3,-1.55
INDUCTOR = smd 3.5 x 5.4: 1 -5.45,0; 2 5.45,0
RGBLED = smd 0.8 x 0.8: A 0,0.75; C 0,-0.75
B1,27 = smd 1.27 x 1.27: TP 0,0
MA20-2 = drill 1.016 octagon: 1 -24.13,-1.27; 2 -24.13,1.27; 3 -21.59,-1.27; 4 -21.59,1.27; 5 -19.05,-1.27; 6 -19.05,1.27; 7 -16.51,-1.27; 8 -16.51,1.27; 9 -13.97,-1.27; 10 -13.97,1.27; 11 -11.43,-1.27; 12 -11.43,1.27; 13 -8.89,-1.27; 14 -8.89,1.27; 15 -6.35,-1.27; 16 -6.35,1.27; 17 -3.81,-1.27; 18 -3.81,1.27; 19 -1.27,-1.27; 20 -1.27,1.27; 21 1.27,-1.27; 22 1.27,1.27; 23 3.81,-1.27; 24 3.81,1.27; 25 6.35,-1.27; 26 6.35,1.27; 27 8.89,-1.27; 28 8.89,1.27; 29 11.43,-1.27; 30 11.43,1.27; 31 13.97,-1.27; 32 13.97,1.27; 33 16.51,-1.27; 34 16.51,1.27; 35 19.05,-1.27; 36 19.05,1.27; 37 21.59,-1.27; 38 21.59,1.27; 39 24.13,-1.27; 40 24.13,1.27
TRIMPOT = smd 1.3 x 1.3: 1 1.15,2.75; 3 -1.15,2.75 | smd 2 x 1.3: 2 0,-2.75
MOSFET = smd 1 x 0.75: 1 0.5,-1.905; 2 0.5,-0.635; 3 0.5,0.635; 4 0.5,1.905 | smd 4.53 x 4.56: TAB -3.23,0
SOT23_FAN = smd 0.9 x 0.8: 1 1,-1; 2 1,1; 3 -1,0
R0603 = smd 1 x 1.1: 1 -0.85,0; 2 0.85,0
R0805 = smd 1.3 x 1.5: 1 -0.95,0; 2 0.95,0
BUTTON = smd 1.55 x 1.3: 1 -3.975,2.25; 2 3.975,2.25; 3 -3.975,-2.25; 4 3.975,-2.25
CRYSTAL = smd 1.2 x 1: 1 -0.85,-0.65; 2 0.85,-0.65; 3 0.85,0.65; 4 -0.85,0.65

### Placement (x,y rotation side)
+12V  4.56,34.72 90 top
ANT  67.57,30.8 90 bottom
BAL  65.51,36.72 180 bottom
BED  14.48,34.04 180 top
C1  67.31,36.58 270 bottom
C1_M1  50.19,12.72 180 bottom
C1_M2  34.95,12.72 180 bottom
C1_M3  19.71,12.72 180 bottom
C1_M4  4.47,12.72 180 bottom
C1_REG  29.02,44 270 top
C2_M1  59.44,13.59 90 bottom
C2_M2  44.2,13.59 90 bottom
C2_M3  28.96,13.59 90 bottom
C2_M4  13.72,13.59 90 bottom
C2_REG  15.26,44 90 top
C3_M1  50.19,14.25 180 bottom
C3_M2  34.95,14.25 180 bottom
C3_M3  19.71,14.25 180 bottom
C3_M4  4.47,14.25 180 bottom
C3_REG  54.39,46.66 270 bottom
C4_M1  50.19,11.2 0 bottom
C4_M2  34.95,11.2 0 bottom
C4_M3  19.71,11.2 0 bottom
C4_M4  4.47,11.2 0 bottom
C4_REG  61.24,48.16 180 bottom
C5_M1  51.84,9.55 180 bottom
C5_M2  36.6,9.55 180 bottom
C5_M3  21.36,9.55 180 bottom
C5_M4  6.12,9.55 180 bottom
C5_REG  54.74,43.34 0 bottom
C6_M1  60.6,19.71 180 bottom
C6_M2  43.33,20.98 180 bottom
C6_M3  28.09,20.98 180 bottom
C6_M4  13.11,20.98 180 bottom
C7_M1  55.02,6.88 180 bottom
C7_M2  39.77,6.88 180 bottom
C7_M3  24.54,6.88 180 bottom
C7_M4  9.29,6.88 180 bottom
C8_M1  56.03,12.47 180 bottom
C8_M2  40.79,12.47 180 bottom
C8_M3  25.55,12.47 180 bottom
C8_M4  10.31,12.47 180 bottom
C9  64.26,25.4 180 bottom
C10  68.07,40.13 90 bottom
C11  64.26,31.24 180 bottom
C12  61.72,28.45 270 bottom
C13  54.73,41.57 0 bottom
C14  55.63,33.78 270 bottom
C15  65.02,33.78 270 bottom
CFG1_E  15.75,19.3 90 top
CFG2_E  5.59,22.23 90 top
CHG1_X  61.47,19.3 90 top
CHG1_Y  46.23,19.3 90 top
CHG1_Z  30.99,19.3 90 top
CHG2_X  48.77,19.3 90 top
CHG2_Y  33.53,19.3 90 top
CHG2_Z  18.29,19.3 90 top
D1_REG  27.94,44.44 270 bottom
E  12.7,3.81 0 top
END_X  49.28,34.04 180 top
END_Y  42.16,34.04 180 top
END_Z  35.05,34.04 180 top
FAN1  35.05,25.15 180 top
FAN2  27.94,25.15 180 top
IC1  60.45,37.85 180 bottom
IC1_REG  32,43.5 0 bottom
IC2_REG  57.29,47.28 180 bottom
IC_M1  55.27,17.04 270 bottom
IC_M2  40.03,17.04 270 bottom
IC_M3  24.79,17.04 270 bottom
IC_M4  9.55,17.04 270 bottom
L1_REG  18.36,42.78 0 bottom
LED  61.4,40.64 0 top
NOZZLE  26.67,34.04 180 top
OUTLINE  0,0 0 top
P0.17  65.28,42.93 0 top
P0.21  56.64,29.97 0 top
PI_HEADER  32.5,52.5 0 top
POT_M1  60.09,8.91 90 bottom
POT_M2  44.85,8.91 90 bottom
POT_M3  29.61,8.91 90 bottom
POT_M4  14.38,8.91 90 bottom
Q1_BED  9.4,26.92 0 bottom
Q1_FAN1  37.85,28.19 180 bottom
Q1_FAN2  30.73,28.19 180 bottom
Q1_NOZ  19.05,26.92 0 bottom
R1_BED  10.16,31.24 270 bottom
R1_FAN1  43.18,29.21 0 bottom
R1_FAN2  43.18,30.73 0 bottom
R1_LED  61.98,44.2 180 bottom
R1_M1  56.03,10.95 0 bottom
R1_M2  40.79,10.95 0 bottom
R1_M3  25.55,10.95 0 bottom
R1_M4  10.31,10.95 0 bottom
R1_NOZ  20.32,31.5 270 bottom
R1_SWA  61.98,45.72 180 bottom
R1_SWX  54.1,33.78 270 bottom
R1_SWY  46.99,34.04 270 bottom
R1_SWZ  39.88,34.04 270 bottom
R2_BED  8.38,31.24 270 bottom
R2_FAN1  40.39,28.19 90 bottom
R2_FAN2  33.27,28.19 90 bottom
R2_M1  62.33,13.56 90 bottom
R2_M2  46,18.31 270 bottom
R2_M3  30.76,18.31 270 bottom
R2_M4  15.52,18.31 270 bottom
R2_NOZ  16.76,26.42 90 bottom
R3_BED  50.29,27.18 180 bottom
R3_M1  49.3,18.31 270 bottom
R3_M2  34.06,18.31 270 bottom
R3_M3  18.82,18.31 270 bottom
R3_M4  3.58,18.31 270 bottom
R3_NOZ  43.18,27.18 180 bottom
R4_M1  55.02,8.41 180 bottom
R4_M2  39.77,8.41 180 bottom
R4_M3  24.54,8.41 180 bottom
R4_M4  9.29,8.41 180 bottom
SWA  57.66,46.23 0 top
SWD  66.79,49.57 90 top
TEMP_BED  49.28,25.15 180 top
TEMP_NOZZLE  42.16,25.15 180 top
X  50.8,3.81 0 top
Y  38.1,3.81 0 top
Y1  64.26,28.19 90 bottom
Z  25.4,3.81 0 top

### Tracks (layer width: path | path; a pad name or v marks a point on that pad's centre or on a via)
5V_M1
  Bottom 0.152: IC_M1.25 54.52,13.13 C8_M1.1 R1_M1.2 55.18,9.09 R4_M1.2
5V_M2
  Bottom 0.152: IC_M2.25 39.28,13.13 C8_M2.1 R1_M2.2 39.94,9.09 R4_M2.2
5V_M3
  Bottom 0.152: IC_M3.25 24.04,13.13 C8_M3.1 R1_M3.2 24.7,9.09 R4_M3.2
5V_M4
  Bottom 0.152: IC_M4.25 8.8,13.13 C8_M4.1 R1_M4.2 9.46,9.09 R4_M4.2
+3V3  (via drill 0.33)
  Top 0.152: v55.37,27.43 55.37,35.56 v55.63,35.81 | CHG1_X.3 v59.94,20.83 | v12.7,22.1 11.68,21.08 9.65,21.08 8.38,22.35 8.38,22.86 7.62,23.62 5.71,23.62 CFG2_E.3 | v57.15,34.8 57.4,35.05 v57.4,41.15 | v64.01,44.96 63.25,44.96
  Top 0.254: CHG2_X.3 50.04,22.1 56.64,22.1 | CHG1_Y.3 44.96,22.1 v43.18,22.1 41.91,20.83 39.37,20.83 38.86,21.34 38.86,22.1 38.35,22.61 36.32,22.61 34.54,20.83 CHG2_Y.3 | CHG1_Z.3 29.72,22.1 v27.94,22.1 26.67,20.83 24.13,20.83 23.62,21.34 23.62,22.1 23.11,22.61 20.07,22.61 CHG2_Z.3 | CFG1_E.3 13.97,20.83 v12.7,22.1 | 56.64,22.1 58.67,24.13 62.48,24.13 64.01,25.65 64.01,44.2 63.25,44.96 56.9,44.96 v56.64,44.7 | v59.94,20.83 57.91,20.83 56.64,22.1
  Bottom 0.152: 55.58,43.24 C5_REG.1 | 42.08,20.57 C6_M2.1 42.42,21.04 42.42,21.08 | R3_NOZ.2 45.05,28.19 50.29,28.19 51.14,27.34 R3_BED.2 55.12,27.18 v55.37,27.43 | C6_M3.1 26.82,20.98 | C6_M4.1 11.85,20.83 | R1_SWZ.2 40.55,32.51 46.32,32.51 R1_SWY.2 47.66,32.51 53.68,32.51 R1_SWX.2 55.63,34.46 C14.1 v55.63,35.81 | IC1.1 57.45,35.1 v57.15,34.8 | v57.4,41.15 57.45,41.1 IC1.12 | R1_SWA.2 63.25,45.72 v64.01,44.96
  Bottom 0.254: 55.58,43.24 C13.1 57.1,40.05 IC1.12 | C14.1 56.58,35.65 IC1.1 | IC_M2.8 41.28,20.2 41.66,20.57 42.08,20.57 | IC2_REG.5 55.69,45.27 C5_REG.1 55.69,43.75 v56.64,44.7 | IC_M1.8 56.52,20.2 56.9,20.57 58.89,20.57 C6_M1.1 59.75,20.38 v59.94,20.83 | IC_M3.8 26.04,20.2 26.82,20.98 | IC_M4.8 10.8,20.45 11.18,20.83 11.85,20.83 | 27.24,21.14 C6_M3.1 27.24,21.4 v27.94,22.1 | v43.18,22.1 42.48,21.4 C6_M2.1 | v12.7,22.1 12.26,21.65 C6_M4.1 | CFG1_E.3 CHG2_Z.3 | CHG1_Y.3 CHG2_X.3 | CHG1_Z.3 CHG2_Y.3
  other vias: 18.29,20.83 15.75,20.83 48.77,20.83 46.23,20.83 33.53,20.83 30.99,20.83
+5V  (via drill 0.33)
  Top 0.406: C2_REG.+ 11.39,47.03 v10.16,48.26
  Bottom 0.152: 11.94,43.75 L1_REG.2 13.31,43.18 13.46,43.18 16.76,46.48 25.15,46.48 26.92,44.7 29.46,44.7 29.96,45.2 IC1_REG.4
  Bottom 0.406: PI_HEADER.4 PI_HEADER.2 7.29,53.77 6.1,52.58 6.1,49.78 7.62,48.26 v10.16,48.26 10.92,48.26 11.94,47.24 11.94,43.75
+12V  (via drill 0.33)
  Top 0.152: C1_REG.+ 32.13,43.05
  Top 0.254: v14.73,15.49 14.73,14.48 15.49,13.72 | v18.54,15.49 18.54,13.72 | v30.23,14.99 30.23,13.72 | v34.04,15.49 34.04,13.97 | v45.21,15.24 45.21,13.97 | v60.71,14.99 60.71,13.97 | v49.02,15.75 49.02,13.97
  Top 0.406: 32.13,43.05 v28.96,39.88
  Bottom 0.152: IC_M1.31 IC_M1.30 52.25,15.77 | C4_M1.2 49.52,11.2 C1_M1.2 | IC_M2.31 IC_M2.30 37.01,15.77 | C4_M2.2 34.27,11.2 C1_M2.2 | IC_M3.31 IC_M3.30 21.77,15.77 | C4_M3.2 19.04,11.2 C1_M3.2 | IC_M4.31 IC_M4.30 6.53,15.77 | C4_M4.2 3.79,11.2 C1_M4.2 C3_M4.2 | 54.28,47.5 C3_REG.1 | v28.96,39.88 31.78,39.88 IC1_REG.1 | 14.58,15.64 v14.73,15.49 | IC2_REG.3 58.24,47.83 57.91,47.5 56.64,47.5 56.39,47.75 56.39,48.58 IC2_REG.1 | 13.72,15.62 13.74,15.64 | C2_M3.2 28.98,14.46 | 44.22,14.46 C2_M2.2 | 59.46,14.46 C2_M1.2
  Bottom 0.254: 59.46,15.49 59.46,15.64 58.81,16.29 IC_M1.16 | C1_M1.2 C3_M1.2 51.04,15.22 | 44.22,15.49 44.22,15.64 43.57,16.29 IC_M2.16 | C1_M2.2 C3_M2.2 35.8,15.22 | 28.98,15.49 28.98,15.64 28.33,16.29 IC_M3.16 | C1_M3.2 C3_M3.2 20.56,15.22 | IC_M4.16 13.09,16.29 13.74,15.64 14.58,15.64 | C3_M4.2 5.32,15.22 | 5.32,15.22 3.06,15.22 v2.54,15.75 | 20.56,15.22 18.81,15.22 v18.54,15.49 | v30.23,14.99 29.72,15.49 28.98,15.49 | 35.8,15.22 34.3,15.22 v34.04,15.49 | 51.04,15.22 49.55,15.22 v49.02,15.75 | v60.71,14.99 60.2,15.49 59.46,15.49 | 44.22,15.49 44.96,15.49 v45.21,15.24 | C2_M4.2 13.72,15.62 | 28.98,14.46 28.98,15.49 | 44.22,15.49 44.22,14.46 | 59.46,15.49 59.46,14.46 | IC_M1.30 51.61,15.79 51.04,15.22 | IC_M2.30 36.37,15.79 35.8,15.22 | IC_M3.30 21.13,15.79 20.56,15.22 | IC_M4.30 5.89,15.79 5.32,15.22
  Bottom 0.406: 28.45,36.83 32.77,36.83 | 32.77,36.83 46.74,36.83 48.26,38.35 48.26,45.47 50.29,47.5 54.28,47.5 | C3_REG.1 55.41,48.63 IC2_REG.1 | 32.77,33.27 32.77,36.83 | 32.77,33.27 32.77,32.77 27.94,28.45 FAN2.2 | FAN1.2 35.05,30.99 32.77,33.27
  pour Bottom (isolate 0.406): 3.81,44.96 6.1,44.96 7.87,43.18 7.87,39.37 8.89,38.35 23.88,38.35 24.89,37.34 26.29,33.53 25.91,33.15 22.35,33.15 21.97,33.53 21.97,34.54 20.83,35.69 14.73,35.69 14.1,35.05 14.1,33.53 13.72,33.15 10.16,33.02 8.64,34.8 3.81,34.8 2.29,36.07 2.29,43.43
  pour Bottom (isolate 0.406): 23.88,38.35 26.42,38.35 28.7,40.64 33.02,40.64 33.02,39.37 29.21,35.56 26.29,35.56 26.29,33.53 24.89,37.34
  pour Top (isolate 0.406): 0,43.5 1.5,45 6.5,45 8,43.5 8,36 7,35 2.73,35 2.73,14.5 3.23,14 65,14 65,3.5 arc-90 61.5,0 3.5,0 arc-90 0,3.5
AIN_M1  (via drill 0.51)
  Bottom 0.152: POT_M1.2 57.05,8.91 | 57.05,8.91 56.03,9.93 56.03,13.23 55.52,13.74 IC_M1.23 | 57.05,8.91 57.05,5.74 v56.64,5.33
AIN_M2  (via drill 0.51)
  Bottom 0.152: IC_M2.23 40.28,13.74 40.79,13.23 40.79,9.93 41.81,8.91 POT_M2.2 42.1,7.17 v43.94,5.33
AIN_M3  (via drill 0.51)
  Bottom 0.152: IC_M3.23 25.04,13.74 25.55,13.23 25.55,9.93 26.57,8.91 POT_M3.2 26.86,7.93 28.7,6.1 30.48,6.1 v31.24,5.33
AIN_M4  (via drill 0.51)
  Bottom 0.152: IC_M4.23 9.8,13.74 10.31,13.23 10.31,9.93 11.33,8.91 POT_M4.2 11.62,8.19 13.72,6.1 17.78,6.1 v18.54,5.33
ANT
  Bottom 0.152: 67.78,34.51 ANT.1 66.79,34.3 66.04,35.05 66.04,36.29 BAL.1
BED  (via drill 0.33)
  Top 0.152: v11.94,32 12.45,32.51 19.3,32.51 19.81,33.02 19.81,36.32 21.08,37.59 46.74,37.59 49.28,40.13 v50.55,40.13
  Bottom 0.152: R1_BED.1 10.25,32 v11.94,32 | IC1.9 55.9,38.85 55.37,39.37 51.31,39.37 v50.55,40.13
BED-  (via drill 0.33)
  other vias: 10.92,25.15 11.75,25.15 14.22,25.15 13.4,26.04 13.4,28.7 10.92,27.81 10.92,28.7 14.22,28.7 14.22,27.81 11.75,28.7 11.75,26.04 14.22,26.04 13.4,27.81 13.4,25.15 10.92,26.04 11.75,27.81 11.75,26.92 10.92,26.92 13.4,26.92 14.22,26.92 12.57,28.7 12.57,27.81 12.57,26.92 12.57,26.04 12.57,25.15
  pour Bottom (isolate 0.406): 14.86,34.54 14.86,33.27 10.79,29.21 14.73,27.3 19.43,32 19.43,34.54 19.05,34.92 15.24,34.92
  pour Top: 10.16,29.46 15.24,29.46 15.24,24.38 10.16,24.38
BEDG
  Bottom 0.152: R1_BED.2 10.16,30.09 Q1_BED.4 8.38,29.34 R2_BED.2
BRA_M1
  Bottom 0.152: IC_M1.33 49.37,17.29 R3_M1.2
BRA_M2
  Bottom 0.152: IC_M2.33 34.13,17.29 R3_M2.2
BRA_M3
  Bottom 0.152: IC_M3.33 18.89,17.29 R3_M3.2
BRA_M4
  Bottom 0.152: IC_M4.33 3.65,17.29 R3_M4.2
BRB_M1
  Bottom 0.152: IC_M1.14 60.18,17.29 62.33,15.14 R2_M1.2
BRB_M2
  Bottom 0.152: IC_M2.14 45.93,17.29 R2_M2.2
BRB_M3
  Bottom 0.152: IC_M3.14 30.69,17.29 R2_M3.2
BRB_M4
  Bottom 0.152: IC_M4.14 15.45,17.29 R2_M4.2
CFG1_M1  (via drill 0.33)
  Top 0.152: v54.86,21.34 55.88,20.32 59.18,20.32 60.2,19.3 CHG1_X.2
  Bottom 0.152: IC_M1.4 54.52,20.99 v54.86,21.34
CFG1_M2  (via drill 0.33)
  Top 0.152: v37.85,21.59 39.12,20.32 44.45,20.32 45.47,19.3 CHG1_Y.2
  Bottom 0.152: IC_M2.4 39.28,20.41 38.1,21.59 v37.85,21.59
CFG1_M3  (via drill 0.33)
  Top 0.152: v22.61,21.59 22.61,21.08 23.37,20.32 28.96,20.32 29.97,19.3 CHG1_Z.2
  Bottom 0.152: IC_M3.4 24.04,20.41 23.37,21.08 23.11,21.08 v22.61,21.59
CFG1_M4  (via drill 0.33)
  Top 0.152: v8.13,21.34 9.14,20.32 13.97,20.32 14.99,19.3 CFG1_E.2
  Bottom 0.152: IC_M4.4 8.8,20.66 v8.13,21.34
CFG2_M1  (via drill 0.33)
  Top 0.152: CHG2_X.2 49.78,19.3 51.31,20.83 v53.59,20.83
  Bottom 0.152: IC_M1.3 54.02,20.4 v53.59,20.83
CFG2_M2  (via drill 0.33)
  Top 0.152: CHG2_Y.2 34.04,19.3 36.07,21.34 v36.58,21.34
  Bottom 0.152: IC_M2.3 38.78,20.15 38.35,20.57 37.34,20.57 v36.58,21.34
CFG2_M3  (via drill 0.33)
  Top 0.152: CHG2_Z.2 19.05,19.3 20.57,20.83 v21.59,20.83
  Bottom 0.152: IC_M3.3 23.54,20.15 23.11,20.57 21.84,20.57 v21.59,20.83
CFG2_M4  (via drill 0.33)
  Top 0.152: v7.11,22.61 6.6,22.1 5.71,22.1 CFG2_E.2
  Bottom 0.152: IC_M4.3 8.3,20.15 7.87,20.57 7.62,20.57 7.11,21.08 v7.11,22.61
CPI_M1
  Bottom 0.152: 51.2,9.55 C5_M1.1 52.86,11.41 52.86,14.38 IC_M1.28
CPI_M2
  Bottom 0.152: 35.97,9.55 C5_M2.1 37.62,11.41 37.62,14.38 IC_M2.28
CPI_M3
  Bottom 0.152: 20.73,9.55 C5_M3.1 22.38,11.41 22.38,14.38 IC_M3.28
CPI_M4
  Bottom 0.152: 5.49,9.55 C5_M4.1 7.14,11.41 7.14,14.38 IC_M4.28
CPO_M1
  Bottom 0.152: C5_M1.2 53.52,10.38 IC_M1.27
CPO_M2
  Bottom 0.152: C5_M2.2 38.28,10.38 IC_M2.27
CPO_M3
  Bottom 0.152: C5_M3.2 23.04,10.38 IC_M3.27
CPO_M4
  Bottom 0.152: C5_M4.2 7.8,10.38 IC_M4.27
DIR_M1  (via drill 0.33)
  Top 0.152: v59.18,21.59 60.71,23.11 62.99,23.11 65.02,25.15 65.02,39.12 v66.55,40.64
  Bottom 0.152: IC_M1.7 56.02,20.46 56.64,21.08 58.67,21.08 v59.18,21.59 | v66.55,40.64 65.15,39.25 IC1.27
DIR_M2  (via drill 0.33)
  Top 0.152: v41.15,21.59 41.15,21.84 42.67,23.11 56.13,23.11 58.17,25.15 61.72,25.15 62.99,26.42 62.99,42.04 v62.36,42.67
  Bottom 0.152: IC_M2.7 40.78,21.22 v41.15,21.59 | IC1.21 61.45,41.77 v62.36,42.67
DIR_M3  (via drill 0.33)
  Top 0.152: v25.91,21.59 25.91,22.86 26.16,23.11 26.16,27.18 26.92,27.94 50.8,27.94 v51.31,28.45
  Bottom 0.152: IC_M3.7 25.54,21.22 v25.91,21.59 | v51.31,28.45 51.56,28.7 57.66,28.7 60.65,31.7 IC1.42
DIR_M4  (via drill 0.33)
  Top 0.152: v10.92,21.84 12.19,23.11 16.26,23.11 17.53,24.38 17.53,29.72 18.29,30.48 26.42,30.48 27.43,29.46 44.96,29.46 46.48,29.46 v47.24,30.23
  Top 0.254: 44.96,29.46 45.21,29.46
  Bottom 0.152: IC_M4.7 10.3,21.22 v10.92,21.84 | v47.24,30.23 47.75,30.73 56.64,30.73 59.05,33.14 IC1.46
EN_M1  (via drill 0.33)
  Top 0.152: v64.77,22.61 65.53,23.37 65.53,38.35 v66.55,39.37
  Bottom 0.152: IC_M1.22 56.02,13.96 56.39,13.59 61.46,13.59 61.47,13.59 63.37,13.59 64.01,14.22 64.01,21.84 v64.77,22.61 | v66.55,39.37 66.02,38.85 IC1.28
EN_M2  (via drill 0.33)
  Top 0.152: v46.99,16 47.5,16.51 47.5,21.59 48.51,22.61 56.39,22.61 58.42,24.64 61.98,24.64 63.5,26.16 63.5,42.42 v63.25,42.67
  Bottom 0.152: IC_M2.22 40.78,13.96 41.15,13.59 46.1,13.59 46.99,14.48 v46.99,16 | IC1.22 61.85,41.53 62.42,42.1 62.67,42.1 v63.25,42.67
EN_M3  (via drill 0.33)
  Top 0.152: v32,16 32.26,16.26 32.26,21.59 30.99,22.86 27.43,22.86 26.67,23.62 26.67,26.92 27.18,27.43 52.07,27.43 v52.58,27.94
  Bottom 0.152: IC_M3.22 25.54,14.09 26.04,13.59 31.11,13.59 32,14.48 v32,16 | v52.58,27.94 52.83,28.19 57.91,28.19 61.05,31.33 IC1.41
EN_M4  (via drill 0.33)
  Top 0.152: v16.51,16 17.02,16.51 17.02,23.11 18.03,24.13 18.03,29.46 18.54,29.97 26.16,29.97 27.18,28.96 47.75,28.96 v48.51,29.72
  Bottom 0.152: IC_M4.22 10.3,13.96 10.67,13.59 15.37,13.59 16.51,14.73 v16.51,16 | v48.51,29.72 49.02,30.23 56.9,30.23 59.45,32.78 IC1.45
FAN1
  Bottom 0.152: R1_FAN1.1 44.54,28.7 50.29,28.7 50.8,29.21 57.4,29.21 60.25,32.06 IC1.43
FAN1-
  Bottom 0.152: FAN1.1 36.85,25.89 Q1_FAN1.3
FAN1G
  Bottom 0.152: Q1_FAN1.1 40.24,29.19 R2_FAN1.2 42.16,29.04 R1_FAN1.2
FAN2
  Bottom 0.152: IC1.48 58.25,33.87 56.13,31.75 45.21,31.75 44.2,30.73 R1_FAN2.1
FAN2-
  Bottom 0.152: Q1_FAN2.3 30.48,27.45 FAN2.1
FAN2G  (via drill 0.33)
  Top 0.152: v33.02,31.24 v41.15,31.24
  Bottom 0.152: Q1_FAN2.1 31.88,29.04 R2_FAN2.2 33.27,30.99 v33.02,31.24 | v41.15,31.24 41.66,30.73 R1_FAN2.2
GND  (via drill 0.33, 0.6)
  Top 0.152: 63.5,15.49 v62.74,16.26
  Top 0.254: v17.27,13.46 17.27,14.99 | v47.5,13.21 47.5,14.99 | v32.26,13.21 32.51,13.46 32.51,14.99 | v63.5,11.68 63.5,15.49
  Bottom 0.152: 58.25,40.05 IC1.PAD 60.45,37.59 v59.69,36.83 | 61.48,36.85 v61.47,36.83 61.85,36.45 | IC1.34 64.14,36.45 64.77,35.81 65.28,35.81 65.51,36.04 BAL.2 65.51,36.45 66.01,36.95 | 66.01,36.95 BAL.6 | 57.52,18.34 IC_M1.TVIA17 | 55.02,18.34 IC_M1.TVIA9 | 53.02,18.34 IC_M1.TVIA1 | IC_M1.35 | 53.34,18.79 53.85,18.29 | 57.15,18.29 56.9,18.54 | 57.4,18.79 56.9,18.29 | 55.02,15.49 IC_M1.TVIA12 | 39.78,18.59 IC_M2.TVIA9 | 38.1,18.79 38.61,18.29 | 38.35,18.29 | 39.78,15.49 IC_M2.TVIA12 | 41.66,18.29 42.28,18.91 | 41.91,18.79 41.4,18.29 | 26.39,18.29 IC_M3.TVIA17 | 26.42,18.29 26.92,18.79 27.04,18.91 | 24.54,18.59 IC_M3.TVIA9 | 23.37,18.29 22.86,18.79 | 23.11,18.29 | 24.54,15.49 IC_M3.TVIA12 | 9.3,18.59 IC_M4.TVIA9 | 7.37,18.79 7.87,18.29 | 10.93,18.29 10.92,18.29 | 11.43,18.79 11.18,18.54 | 11.8,18.91 11.18,18.29 | 9.3,15.49 IC_M4.TVIA12 | 64.88,27.71 Y1.4 64.91,27.54 63.61,28.84 Y1.2 63.58,29.01 | 58.25,41.57 58.17,41.66 | 66.01,36.95 66.38,36.58 v68.33,36.58
  Bottom 0.254: 58.25,40.05 IC1.13 58.25,41.57 | IC1.33 61.48,36.85 | 61.85,36.45 IC1.34 | IC_M1.10 57.52,18.34 | IC_M1.5 55.02,18.34 | IC_M1.1 53.02,18.34 | IC_M1.35 53.59,18.29 | IC_M1.36 53.34,18.79 | IC_M1.12 57.15,18.29 | IC_M1.11 57.4,18.79 | IC_M1.24 55.02,15.49 | IC_M2.5 39.78,18.59 | IC_M2.1 37.78,19.04 IC_M2.TVIA1 | IC_M2.36 38.1,18.79 | IC_M2.35 38.35,18.29 | IC_M2.24 39.78,15.49 | IC_M2.12 41.66,18.29 | IC_M2.11 41.91,18.79 | IC_M2.10 42.28,18.91 | IC_M3.12 26.39,18.29 | 26.92,18.79 IC_M3.11 | 27.04,19.16 IC_M3.10 27.04,18.91 | IC_M3.5 24.54,18.59 | IC_M3.36 22.86,18.79 22.54,19.12 IC_M3.1 | IC_M3.35 23.11,18.29 | IC_M3.24 24.54,15.49 | IC_M4.5 9.3,18.59 | IC_M4.1 7.3,19.04 IC_M4.TVIA1 | IC_M4.36 7.37,18.79 | IC_M4.35 7.87,18.29 | IC_M4.12 10.93,18.29 | IC_M4.11 11.43,18.79 | IC_M4.10 11.8,18.91 | IC_M4.24 9.3,15.49
  other vias: 44.96,48.01 44.96,45.47 44.96,44.2 44.96,42.93 44.96,41.66 44.96,40.39 44.96,39.12 44.96,46.74 41.91,48.01 41.91,45.47 41.91,44.2 41.91,42.93 41.91,41.66 41.91,40.39 41.91,39.12 41.91,46.74 43.43,48.01 43.43,45.47 43.43,44.2 43.43,42.93 43.43,41.66 43.43,40.39 43.43,39.12 43.43,46.74 40.39,48.01 40.39,45.47 40.39,44.2 40.39,42.93 40.39,41.66 40.39,40.39 40.39,39.12 40.39,46.74 56.64,33.78 61.47,38.86 59.69,38.86 49.78,41.66 49.78,42.93 49.78,44.2 1.52,46.74 6.6,19.56 12.45,19.56 21.84,19.56 27.69,19.56 37.08,19.56 42.93,19.56 52.32,19.56 58.42,19.56
  pour Bottom (isolate 0.305, rank 2): 0,52.58 0,3.56 arc90 3.56,0 61.47,0 arc90 65.02,3.56 65.02,20.07 69.47,24.51 69.47,52.7 arc90 66.17,56.01 3.43,56.01 arc90
  pour Top (isolate 0.305, rank 2): 0,52.58 0,3.56 arc90 3.56,0 61.47,0 arc90 65.02,3.56 65.02,20.07 69.47,24.51 69.47,52.7 arc90 66.17,56.01 3.43,56.01 arc90
IC1_ANT1
  Bottom 0.152: BAL.3 64.08,37.25 IC1.32
IC1_ANT2
  Bottom 0.152: BAL.4 64.48,37.65 IC1.31
IC1_AVDD
  Bottom 0.152: IC1.35 IC1.36 64.47,34.63 C15.1
IC1_DEC1
  Bottom 0.152: C12.1 61.85,29.43 IC1.39
IC1_DEC2
  Bottom 0.152: C10.1 67.24,38.45 IC1.29
IC1_REG_OUT
  Bottom 0.152: 24.64,43.61 L1_REG.1 24.25,42.34
  Bottom 0.406: IC1_REG.2 29.75,41.8 29.21,42.34 D1_REG.C 24.25,42.34
IC1_VDD_PA
  Bottom 0.152: IC1.30 65.08,38.05 65.51,37.62 | 65.51,37.62 BAL.5 | C1.1 67.12,37.62 65.51,37.62
IC1_XC1
  Bottom 0.152: IC1.37 63.41,34.09 C11.1 64.91,29.74 Y1.3
IC1_XC2
  Bottom 0.152: IC1.38 62.25,30.71 62.74,30.23 62.74,28.22 Y1.1 63.58,25.56 C9.1
IC2_REG_BYPASS
  Bottom 0.152: 58.24,46.01 IC2_REG.4 58.24,46.31 60.09,48.16 C4_REG.1
LED
  Bottom 0.152: IC1.17 59.85,41.75 59.44,42.16 59.44,42.67 59.94,43.18 60.45,43.18 61.13,43.85 R1_LED.1
LEDA  (via drill 0.33)
  Top 0.152: v60.2,42.42 60.2,41.91 60.45,41.66 61.14,41.66 LED.A
  Bottom 0.152: R1_LED.2 62.83,44.03 61.98,43.18 60.96,43.18 v60.2,42.42
NOZ  (via drill 0.33)
  Top 0.152: v20.83,33.78 20.83,36.07 21.84,37.08 46.99,37.08 48.77,38.86 v50.55,38.86
  Bottom 0.152: IC1.8 55.53,38.45 55.12,38.86 v50.55,38.86 | R1_NOZ.1 20.32,33.27 v20.83,33.78
NOZ-  (via drill 0.33)
  other vias: 20.57,28.7 22.86,28.7 23.88,28.7 23.05,26.04 23.88,25.15 23.05,25.15 20.57,25.15 23.88,27.81 21.4,27.81 23.05,27.81 23.88,26.04 21.4,26.04 21.4,28.7 20.57,27.81 20.57,26.04 21.4,25.15 22.23,28.7 22.23,27.81 22.23,26.04 22.23,25.15 23.88,26.92 23.05,26.92 22.23,26.92 21.4,26.92 20.57,26.92
  pour Bottom (isolate 0.406): 20.32,28.96 23.88,32.51 26.42,32.51 26.92,33.02 27.05,34.54 27.43,34.92 31.24,34.92 31.62,34.54 31.62,32.77 28.83,29.97 26.04,29.84 24.13,27.94
  pour Top: 19.81,29.46 24.89,29.46 24.89,24.38 19.81,24.38
NOZG
  Bottom 0.152: R2_NOZ.2 16.76,27.94 17.65,28.83 Q1_NOZ.4 20.11,30.65 R1_NOZ.2
  Bottom 0.254: 17.82,28.83 Q1_NOZ.4
OA1_M1  (via drill 0.33)
  Top 0.254: X.1 46.99,5.84 50.04,8.89 50.04,17.02 v51.05,18.03
  Bottom 0.254: IC_M1.34 51.3,17.79 v51.05,18.03
OA1_M2  (via drill 0.33)
  Top 0.254: v35.81,18.03 35.05,17.27 35.05,4.57 Y.1
  Bottom 0.254: IC_M2.34 36.06,17.79 v35.81,18.03
OA1_M3  (via drill 0.33)
  Top 0.254: v20.83,18.03 19.56,16.76 19.56,14.99 21.59,12.95 Z.1
  Bottom 0.254: IC_M3.34 21.07,17.79 v20.83,18.03
OA1_M4  (via drill 0.33)
  Top 0.254: E.1 8.89,11.18 4.57,15.49 4.57,17.02 v5.59,18.03
  Bottom 0.254: IC_M4.34 5.83,17.79 v5.59,18.03
OA2_M1  (via drill 0.33)
  Top 0.254: v51.05,16.51 51.05,7.37 49.53,5.84 X.2
  Bottom 0.254: IC_M1.32 51.34,16.79 v51.05,16.51
OA2_M2  (via drill 0.33)
  Top 0.254: v35.81,16.51 36.83,15.49 Y.2
  Bottom 0.254: IC_M2.32 36.1,16.79 v35.81,16.51
OA2_M3  (via drill 0.33)
  Top 0.254: v20.32,16.26 24.13,12.45 Z.2
  Bottom 0.254: IC_M3.32 20.86,16.79 v20.32,16.26
OA2_M4  (via drill 0.33)
  Top 0.254: v5.33,16.51 5.33,16 10.67,10.67 10.67,6.86 11.43,6.1 E.2
  Bottom 0.254: IC_M4.32 5.62,16.79 v5.33,16.51
OB1_M1  (via drill 0.33)
  Top 0.254: X.3 52.07,8.89 58.42,15.24 58.42,17.02 v59.44,18.03
  Bottom 0.254: IC_M1.13 59.19,17.79 v59.44,18.03
OB1_M2  (via drill 0.33)
  Top 0.254: v44.2,18.03 42.67,16.51 42.67,13.72 39.37,10.41 Y.3
  Bottom 0.254: IC_M2.13 43.95,17.79 v44.2,18.03
OB1_M3  (via drill 0.33)
  Top 0.254: v28.96,18.03 27.43,16.51 27.43,13.46 26.67,12.7 Z.3
  Bottom 0.254: IC_M3.13 28.71,17.79 v28.96,18.03
OB1_M4  (via drill 0.33)
  Top 0.254: v13.72,18.03 12.45,16.76 12.45,12.19 11.94,11.68 11.94,7.37 13.97,5.33 E.3
  Bottom 0.254: IC_M4.13 13.47,17.79 v13.72,18.03
OB2_M1  (via drill 0.33)
  Top 0.254: v59.94,16.26 59.94,15.75 54.61,10.41 X.4
  Bottom 0.254: IC_M1.15 59.41,16.79 v59.94,16.26
OB2_M2  (via drill 0.33)
  Top 0.254: v44.7,16.51 43.69,15.49 43.69,13.46 40.89,10.67 40.89,6.6 41.91,5.59 Y.4
  Bottom 0.254: IC_M2.15 44.42,16.79 v44.7,16.51
OB2_M3  (via drill 0.33)
  Top 0.254: v29.46,16.26 29.46,12.95 27.43,10.92 27.43,7.11 29.21,5.33 Z.4
  Bottom 0.254: IC_M3.15 28.93,16.79 v29.46,16.26
OB2_M4  (via drill 0.33)
  Top 0.254: v13.97,16.51 13.97,13.46 17.02,10.41 17.02,6.1 16.51,5.59 E.4
  Bottom 0.254: IC_M4.15 13.69,16.79 v13.97,16.51
P0.17  (via drill 0.33)
  Top 0.152: v64.77,41.15 64.77,42.42 P0.17.TP
  Bottom 0.152: IC1.25 63.67,40.05 v64.77,41.15
P0.21  (via drill 0.33)
  Top 0.152: v56.64,27.43 P0.21.TP
  Bottom 0.152: IC1.40 61.45,30.97 58.17,27.69 56.9,27.69 v56.64,27.43
PI_14_TXD0  (via drill 0.33)
  Top 0.152: v51.82,40.13 51.05,40.89 51.05,45.47 v47.75,48.77
  Bottom 0.152: PI_HEADER.8 17.27,52.49 17.27,50.55 18.54,49.28 47.24,49.28 v47.75,48.77 | IC1.10 56.26,39.25 55.63,39.88 52.07,39.88 v51.82,40.13
PI_15_RXD0  (via drill 0.33)
  Top 0.152: v51.82,41.4 51.82,45.97 v49.28,48.51
  Bottom 0.152: PI_HEADER.10 19.81,52.49 19.81,50.55 20.57,49.78 48.01,49.78 v49.28,48.51 | IC1.11 56.62,39.65 55.88,40.39 52.83,40.39 v51.82,41.4
POT_M1
  Bottom 0.152: POT_M1.1 61.48,11.43 58.67,11.43 58.19,10.95 R1_M1.1
POT_M2
  Bottom 0.152: POT_M2.1 46.24,11.43 43.69,11.43 43.2,10.95 R1_M2.1
POT_M3
  Bottom 0.152: POT_M3.1 31,11.43 28.19,11.43 27.71,10.95 R1_M3.1
POT_M4
  Bottom 0.152: POT_M4.1 15.76,11.43 12.95,11.43 12.47,10.95 R1_M4.1
STEP_M1  (via drill 0.33)
  Top 0.152: v57.91,22.1 59.44,23.62 62.74,23.62 64.52,25.4 64.52,39.88 v66.55,41.91
  Bottom 0.152: IC_M1.6 55.52,20.72 56.39,21.59 57.4,21.59 v57.91,22.1 | v66.55,41.91 65.53,40.89 65.53,40.39 64.79,39.65 IC1.26
STEP_M2  (via drill 0.33)
  Top 0.152: v39.88,21.59 39.88,22.35 41.15,23.62 55.88,23.62 57.91,25.65 61.47,25.65 62.48,26.67 62.48,41.66 61.72,42.42 v61.21,42.42
  Bottom 0.152: IC_M2.6 40.28,21.19 v39.88,21.59 | IC1.20 61.05,42.26 v61.21,42.42
STEP_M3  (via drill 0.33)
  Top 0.152: v24.64,21.59 24.64,22.35 25.65,23.37 25.65,27.43 26.67,28.45 48.77,28.45 v49.78,29.46
  Bottom 0.152: IC_M3.6 25.04,21.19 v24.64,21.59 | v49.78,29.46 50.04,29.72 57.15,29.72 59.85,32.42 IC1.44
STEP_M4  (via drill 0.33)
  Top 0.152: v9.65,22.35 10.92,23.62 16,23.62 17.02,24.64 17.02,29.97 18.03,30.99 26.67,30.99 27.69,29.97 45.21,29.97 v45.97,30.73
  Bottom 0.152: v9.65,22.35 9.8,22.2 IC_M4.6 | v45.97,30.73 46.48,31.24 56.39,31.24 58.65,33.51 IC1.47
SWA  (via drill 0.33)
  Top 0.152: v59.94,43.94 61.6,43.94 SWA.4
  Bottom 0.152: R1_SWA.1 60.87,45.47 60.45,45.47 59.94,44.96 v59.94,43.94 58.93,42.93 58.93,41.91 59.45,41.39 IC1.16
SWDCLK
  Bottom 0.152: IC1.24 63.2,40.85 65.53,43.18 65.53,47.04 SWD.2
SWDIO
  Bottom 0.152: IC1.23 62.25,41.42 62.48,41.66 63.25,41.66 65.02,43.43 65.02,49.07 SWD.3
SWX
  Bottom 0.152: END_X.2 50.55,35.31 53.43,35.31 R1_SWX.1 54.1,35.31 55.24,36.45 IC1.3
SWY
  Bottom 0.152: END_Y.2 43.43,35.31 46.57,35.31 R1_SWY.1 47.92,35.81 53.85,35.81 54.88,36.85 IC1.4
SWZ
  Bottom 0.152: END_Z.2 36.32,35.31 39.46,35.31 R1_SWZ.1 40.81,35.81 47.24,35.81 47.75,36.32 53.59,36.32 54.52,37.25 IC1.5
THBED  (via drill 0.33)
  Top 0.152: TEMP_BED.2 50.55,26.42 53.34,26.42 54.61,27.69 54.61,35.05 v52.58,37.08
  Bottom 0.152: TEMP_BED.2 49.44,25.31 R3_BED.1 | v52.58,37.08 53.14,37.65 IC1.6
THNOZ  (via drill 0.33)
  Top 0.152: TEMP_NOZZLE.2 43.94,26.92 53.09,26.92 54.1,27.94 54.1,34.29 v51.05,37.34
  Bottom 0.152: TEMP_NOZZLE.2 42.33,25.31 R3_NOZ.1 | v51.05,37.34 51.76,38.05 IC1.7
VCC_M1
  Bottom 0.152: IC_M1.26 54.02,8.55 R4_M1.1 C7_M1.1
VCC_M2
  Bottom 0.152: IC_M2.26 38.78,8.55 R4_M2.1 C7_M2.1
VCC_M3
  Bottom 0.152: IC_M3.26 23.54,8.55 R4_M3.1 C7_M3.1
VCC_M4
  Bottom 0.152: IC_M4.26 8.3,8.55 R4_M4.1 C7_M4.1
VCP_M1
  Bottom 0.152: C4_M1.1 51.59,11.2 52.22,11.84 52.22,15.24 IC_M1.29
VCP_M2
  Bottom 0.152: C4_M2.1 36.35,11.2 36.98,11.84 36.98,15.24 IC_M2.29
VCP_M3
  Bottom 0.152: C4_M3.1 21.11,11.2 21.74,11.84 21.74,15.24 IC_M3.29
VCP_M4
  Bottom 0.152: C4_M4.1 5.87,11.2 6.5,11.84 6.5,15.24 IC_M4.29

### Text on the board
tPlace: 3D Printer board / PCB rev1 # | + | adj | adj | adj | adj